# EAGLE design PowerPCB_mk2 (EAGLE 9.4.2)
Assembly variants: basic

## Sheet 1 of 2: DC-DC converters
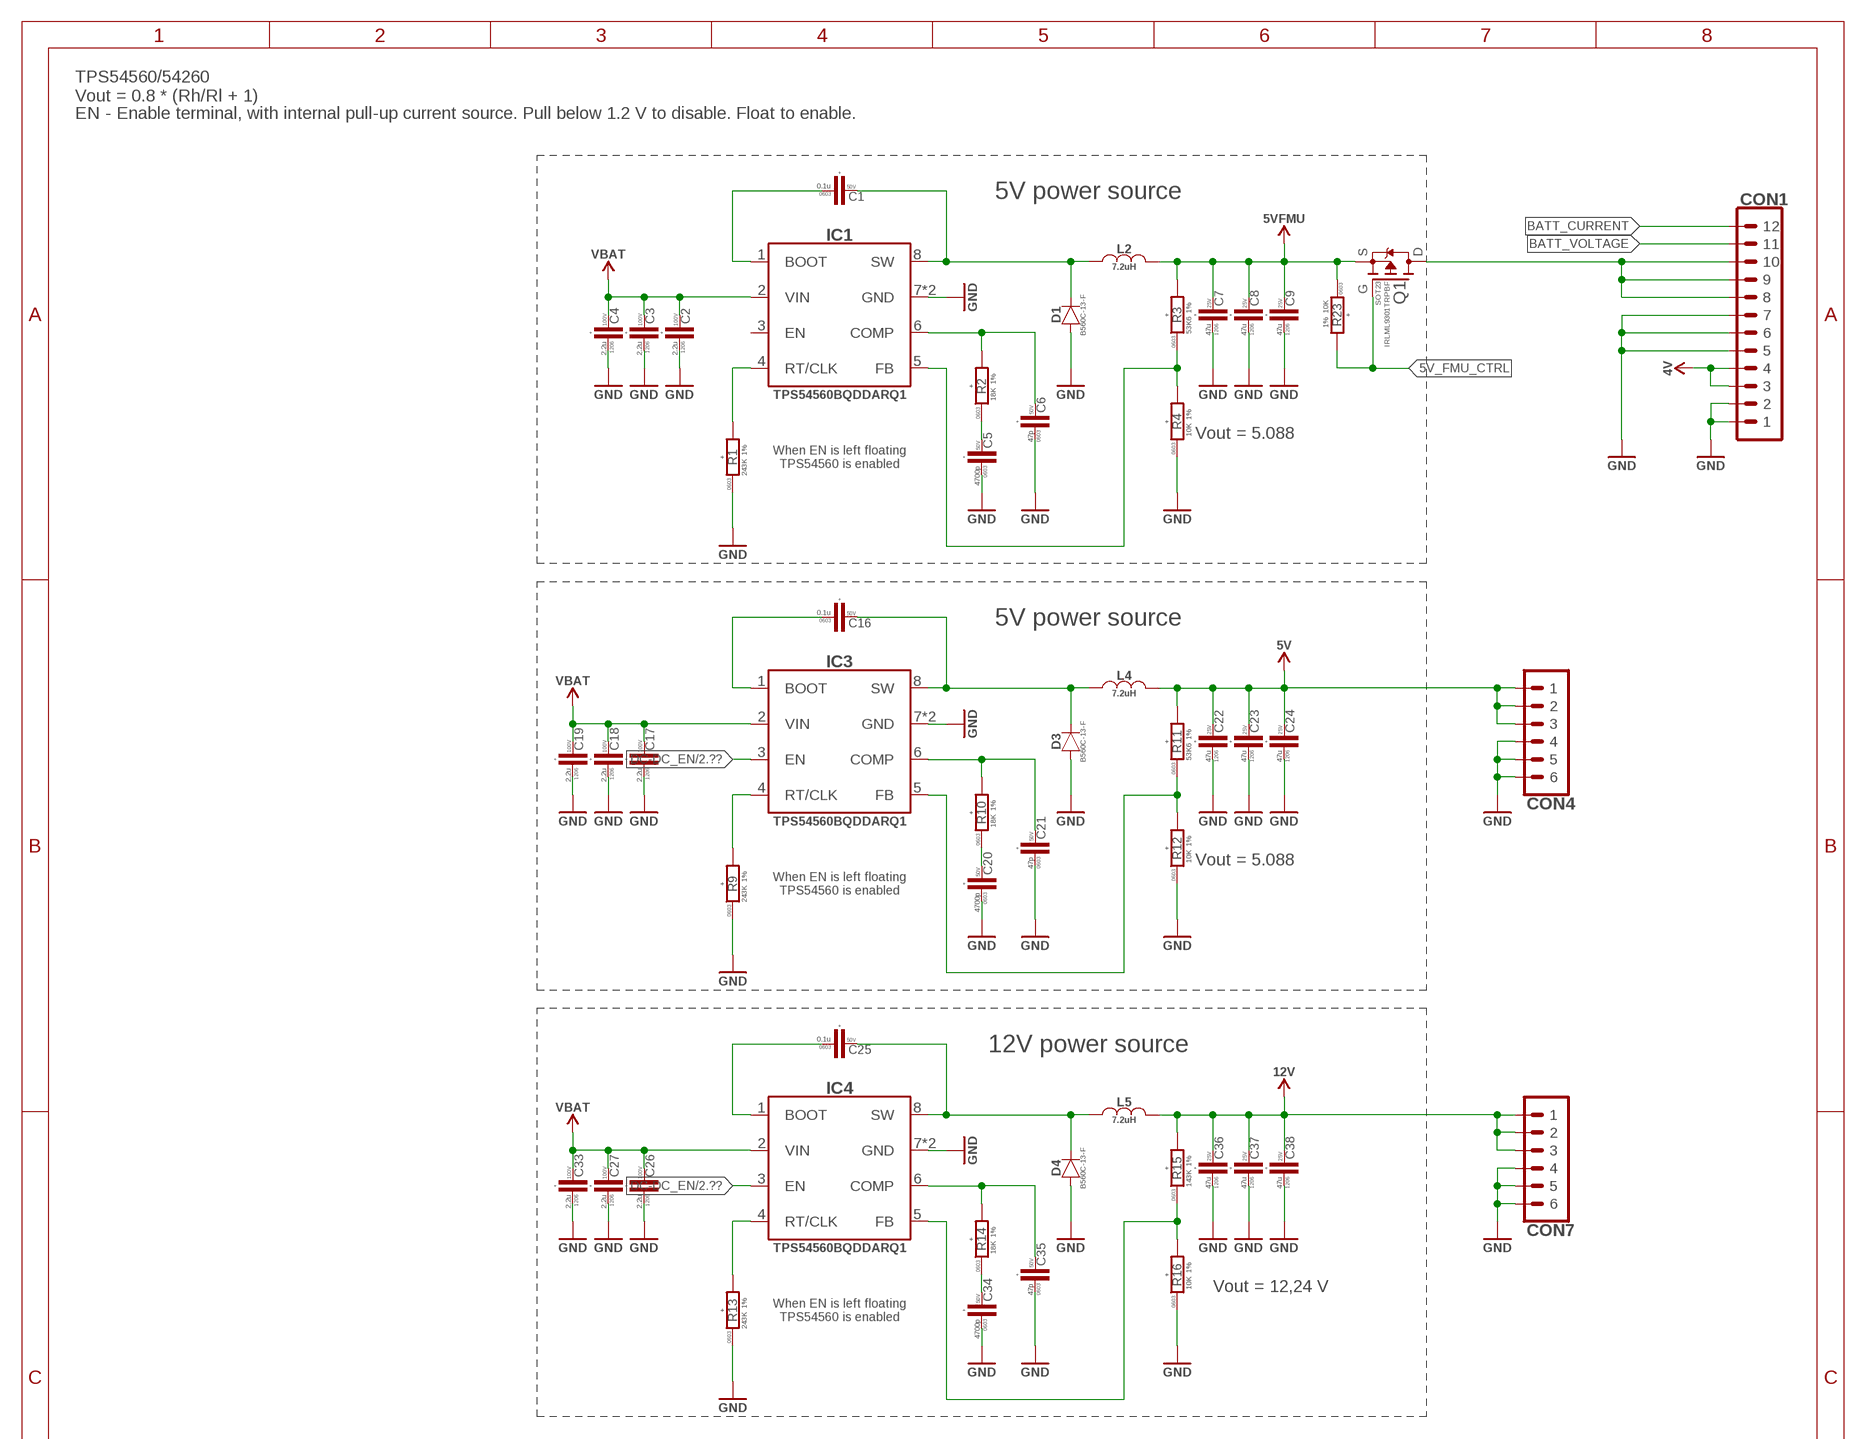
[diagram p0: schematic, sheet 1, part 1 of 2]
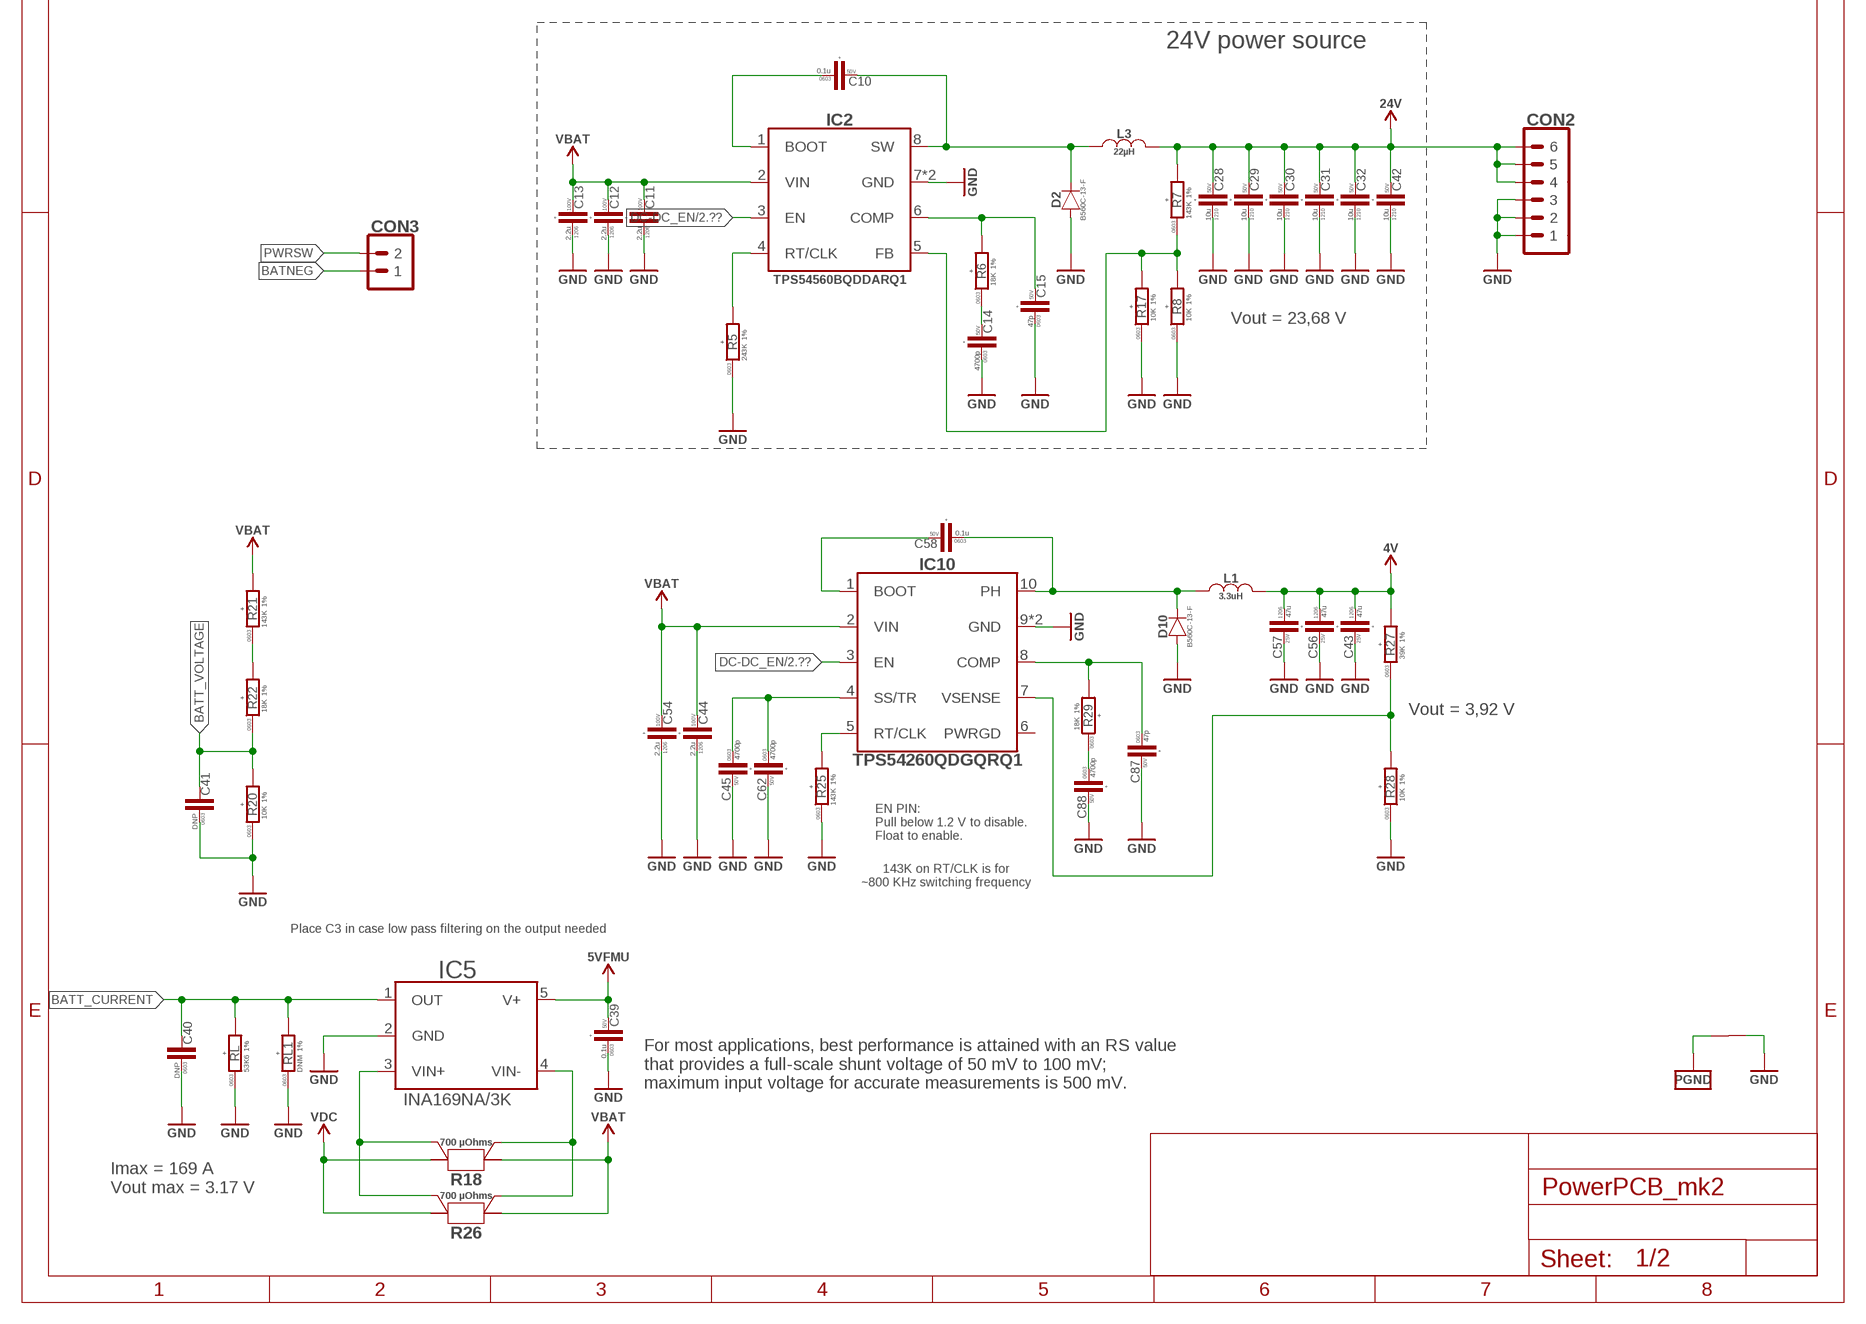
[diagram p1: schematic, sheet 1, part 2 of 2]

### Parts
C1  0.1u  C-0603  [C0603]
C2  2.2u  C-1206  [C1206]
C3  2.2u  C-1206  [C1206]
C4  2.2u  C-1206  [C1206]
C5  4700p  C-0603  [C0603]
C6  47p  C-0603  [C0603]
C7  47u  C-1206  [C1206]
C8  47u  C-1206  [C1206]
C9  47u  C-1206  [C1206]
C10  0.1u  C-0603  [C0603]
C11  2.2u  C-1206  [C1206]
C12  2.2u  C-1206  [C1206]
C13  2.2u  C-1206  [C1206]
C14  4700p  C-0603  [C0603]
C15  47p  C-0603  [C0603]
C16  0.1u  C-0603  [C0603]
C17  2.2u  C-1206  [C1206]
C18  2.2u  C-1206  [C1206]
C19  2.2u  C-1206  [C1206]
C20  4700p  C-0603  [C0603]
C21  47p  C-0603  [C0603]
C22  47u  C-1206  [C1206]
C23  47u  C-1206  [C1206]
C24  47u  C-1206  [C1206]
C25  0.1u  C-0603  [C0603]
C26  2.2u  C-1206  [C1206]
C27  2.2u  C-1206  [C1206]
C28  10u  C-1210  [C1210]
C29  10u  C-1210  [C1210]
C30  10u  C-1210  [C1210]
C31  10u  C-1210  [C1210]
C32  10u  C-1210  [C1210]
C33  2.2u  C-1206  [C1206]
C34  4700p  C-0603  [C0603]
C35  47p  C-0603  [C0603]
C36  47u  C-1206  [C1206]
C37  47u  C-1206  [C1206]
C38  47u  C-1206  [C1206]
C39  0.1u  C-0603  [C0603]
C40  DNP  C-0603  [C0603]  (not fitted in variant basic)
C41  DNP  C-0603  [C0603]  (not fitted in variant basic)
C42  10u  C-1210  [C1210]
C43  47u  C-1206  [C1206]
C44  2.2u  C-1206  [C1206]
C45  4700p  C-0603  [C0603]
C54  2.2u  C-1206  [C1206]
C56  47u  C-1206  [C1206]
C57  47u  C-1206  [C1206]
C58  0.1u  C-0603  [C0603]
C62  4700p  C-0603  [C0603]
C87  47p  C-0603  [C0603]
C88  4700p  C-0603  [C0603]
CON1  PINHEAD_1X12-2.54-FEMALE  [1X12-PTH-2.54-FEMALE]
CON2  PINHEAD_1X06-2.54-FEMALE  [1X06-PTH-2.54-FEMALE]
CON3  PINHEAD_1X02-2.54-FEMALE  [1X02-PTH-2.54-FEMALE]
CON4  PINHEAD_1X06-2.54-FEMALE  [1X06-PTH-2.54-FEMALE]
CON7  PINHEAD_1X06-2.54-FEMALE  [1X06-PTH-2.54-FEMALE]
D1  B560C  [DO-214AB(SMC)]
D2  B560C  [DO-214AB(SMC)]
D3  B560C  [DO-214AB(SMC)]
D4  B560C  [DO-214AB(SMC)]
D10  B560C  [DO-214AB(SMC)]
IC1  TPS54560B  [SOIC8-POWERPAD]
IC2  TPS54560B  [SOIC8-POWERPAD]
IC3  TPS54560B  [SOIC8-POWERPAD]
IC4  TPS54560B  [SOIC8-POWERPAD]
IC5  INA169  [SOT23-5]
IC10  TPS54260  [MSOP10]
J1  CONNECTION-7MM  [CONNECTION_7MM]  (not fitted in variant basic)
L1  3.3uH  3.3µH-IHLP-202BZ  [IHLP-2020BZ-01]
L2  7.2uH  7.2µH-1064  [1064]
L3  22µH  22µH-SRP1265A  [SRP1265A]
L4  7.2uH  7.2µH-1064  [1064]
L5  7.2uH  7.2µH-1064  [1064]
Q1  IRLML9301  [SOT23]
R1  243K  R-1%-0603  [R0603]
R2  18K  R-1%-0603  [R0603]
R3  53K6  R-1%-0603  [R0603]
R4  10K  R-1%-0603  [R0603]
R5  243K  R-1%-0603  [R0603]
R6  18K  R-1%-0603  [R0603]
R7  143K  R-1%-0603  [R0603]
R8  10K  R-1%-0603  [R0603]
R9  243K  R-1%-0603  [R0603]
R10  18K  R-1%-0603  [R0603]
R11  53K6  R-1%-0603  [R0603]
R12  10K  R-1%-0603  [R0603]
R13  243K  R-1%-0603  [R0603]
R14  18K  R-1%-0603  [R0603]
R15  143K  R-1%-0603  [R0603]
R16  10K  R-1%-0603  [R0603]
R17  10K  R-1%-0603  [R0603]
R18  700 µOhms  CURRENT_SHUNT_KELVIN-0.0005R-3920-KELVIN  [R3920-KELVIN]
R20  10K  R-1%-0603  [R0603]
R21  143K  R-1%-0603  [R0603]
R22  18K  R-1%-0603  [R0603]
R23  10K  R-1%-0603  [R0603]
R25  143K  R-1%-0603  [R0603]
R26  700 µOhms  CURRENT_SHUNT_KELVIN-0.0005R-3920-KELVIN  [R3920-KELVIN]
R27  39K  R-1%-0603  [R0603]
R28  10K  R-1%-0603  [R0603]
R29  18K  R-1%-0603  [R0603]
RL  53K6  R-1%-0603  [R0603]
RL1  DNM  R-1%-0603  [R0603]  (not fitted in variant basic)

### Nets
5V_FMU_CTRL: Q1.1(G) R23.2
5VFMU: C7.P$2 C8.P$2 C9.P$2 C39.2 IC5.5(V+) L2.2 Q1.2(S) R3.2 R23.1 ; also sheet 2
BATNEG: CON3.1
BATT_CURRENT: C40.2 CON1.12 IC5.1(OUT) RL1.2 RL.2
BATT_VOLTAGE: C41.2 CON1.11 R20.2 R22.1
BOOT: C58.2 IC10.1(BOOT)
BOOT1: C1.1 IC1.1(BOOT)
BOOT2: C16.1 IC3.1(BOOT)
BOOT3: C25.1 IC4.1(BOOT)
DC-DC_EN: IC2.3(EN) IC3.3(EN) IC4.3(EN) IC10.3(EN) ; also sheet 2
GND: C2.P$1 C3.P$1 C4.P$1 C5.1 C6.1 C7.P$1 C8.P$1 C9.P$1 C11.P$1 C12.P$1 C13.P$1 C14.1 C15.1 C17.P$1 C18.P$1 C19.P$1 C20.1 C21.1 C22.P$1 C23.P$1 C24.P$1 C26.P$1 C27.P$1 C28.1 C29.1 C30.1 C31.1 C32.1 C33.P$1 C34.1 C35.1 C36.P$1 C37.P$1 C38.P$1 C39.1 C40.1 C41.1 C42.1 C43.P$2 C44.P$1 C45.2 C54.P$1 C56.P$2 C57.P$2 C62.2 C87.2 C88.2 CON1.1 CON1.2 CON1.5 CON1.6 CON1.7 CON2.1 CON2.2 CON2.3 CON4.4 CON4.5 CON4.6 CON7.4 CON7.5 CON7.6 D1.A D2.A D3.A D4.A D10.A IC1.7(GND) IC1.P$1(GND) IC2.7(GND) IC2.P$1(GND) IC3.7(GND) IC3.P$1(GND) IC4.7(GND) IC4.P$1(GND) IC5.2(GND) IC10.9(GND) IC10.EP(GND) J1.2 R1.1 R4.1 R5.1 R8.1 R9.1 R12.1 R13.1 R16.1 R17.1 R20.1 R25.1 R28.1 RL1.1 RL.1 ; also sheet 2
N$1: IC1.4(RT/CLK) R1.2
N$2: IC3.4(RT/CLK) R9.2
N$3: C6.2 IC1.6(COMP) R2.2
N$4: C5.2 R2.1
N$5: IC1.5(FB) R3.1 R4.2
N$6: C21.2 IC3.6(COMP) R10.2
N$7: C10.1 IC2.1(BOOT)
N$8: C10.2 D2.C IC2.8(SW) L3.1
N$9: IC2.4(RT/CLK) R5.2
N$10: C15.2 IC2.6(COMP) R6.2
N$11: C14.2 R6.1
N$12: IC2.5(FB) R7.1 R8.2 R17.2
N$13: C20.2 R10.1
N$14: IC4.4(RT/CLK) R13.2
N$15: IC3.5(FB) R11.1 R12.2
N$16: C35.2 IC4.6(COMP) R14.2
N$17: C34.2 R14.1
N$18: IC4.5(FB) R15.1 R16.2
N$19: IC5.4(VIN-) R18.S2 R26.S2
N$20: C45.1 C62.1 IC10.4(SS/TR)
N$21: IC5.3(VIN+) R18.S1 R26.S1
N$22: R21.1 R22.2
N$27: CON1.8 CON1.9 CON1.10 Q1.3(D)
N$38: C87.1 IC10.8(COMP) R29.2
N$39: IC10.5(RT/CLK) R25.2
N$50: C88.1 R29.1
PGND: J1.1 ; also sheet 2
PH: C58.1 D10.C IC10.10(PH) L1.P$1
PWRSW: CON3.2
SW1: C1.2 D1.C IC1.8(SW) L2.1
SW2: C16.2 D3.C IC3.8(SW) L4.1
SW3: C25.2 D4.C IC4.8(SW) L5.1
VBAT [HV]: C2.P$2 C3.P$2 C4.P$2 C11.P$2 C12.P$2 C13.P$2 C17.P$2 C18.P$2 C19.P$2 C26.P$2 C27.P$2 C33.P$2 C44.P$2 C54.P$2 IC1.2(VIN) IC2.2(VIN) IC3.2(VIN) IC4.2(VIN) IC10.2(VIN) R18.2 R18.22 R21.2 R26.2 R26.22 ; also sheet 2
VDC [HV]: R18.1 R18.11 R26.1 R26.11 ; also sheet 2
VDD_4V: C43.P$1 C56.P$1 C57.P$1 CON1.3 CON1.4 L1.P$2 R27.2 ; supply symbol labelled 4V
VDD_5V: C22.P$2 C23.P$2 C24.P$2 CON4.1 CON4.2 CON4.3 L4.2 R11.2 ; supply symbol labelled 5V
VDD_12V: C36.P$2 C37.P$2 C38.P$2 CON7.1 CON7.2 CON7.3 L5.2 R15.2 ; supply symbol labelled 12V
VDD_24V: C28.2 C29.2 C30.2 C31.2 C32.2 C42.2 CON2.4 CON2.5 CON2.6 L3.2 R7.2 ; supply symbol labelled 24V
VSENSE: IC10.7(VSENSE) R27.1 R28.2
Unconnected: IC1.3(EN) IC10.6(PWRGD)

### Notes on the sheet
- TPS54560/54260
  Vout = 0.8 * (Rh/Rl + 1)
- EN - Enable terminal, with internal pull-up current source. Pull below 1.2 V to disable. Float to enable.
- 5V power source
- Vout = 5.088
- When EN is left floating
  TPS54560 is enabled
- 5V power source
- Vout = 5.088
- When EN is left floating
  TPS54560 is enabled
- 12V power source
- Vout = 12,24 V
- When EN is left floating
  TPS54560 is enabled
- 24V power source
- Vout = 23,68 V
- Vout = 3,92 V
- EN PIN:
  Pull below 1.2 V to disable. 
  Float to enable.
- 143K on RT/CLK is for
  ~800 KHz switching frequency
- Place C3 in case low pass filtering on the output needed
- For most applications, best performance is attained with an RS value 
  that provides a full-scale shunt voltage of 50 mV to 100 mV;
  maximum input voltage for accurate measurements is 500 mV.
- Imax = 169 A
  Vout max = 3.17 V

## Sheet 2 of 2: ESC and battery power connections
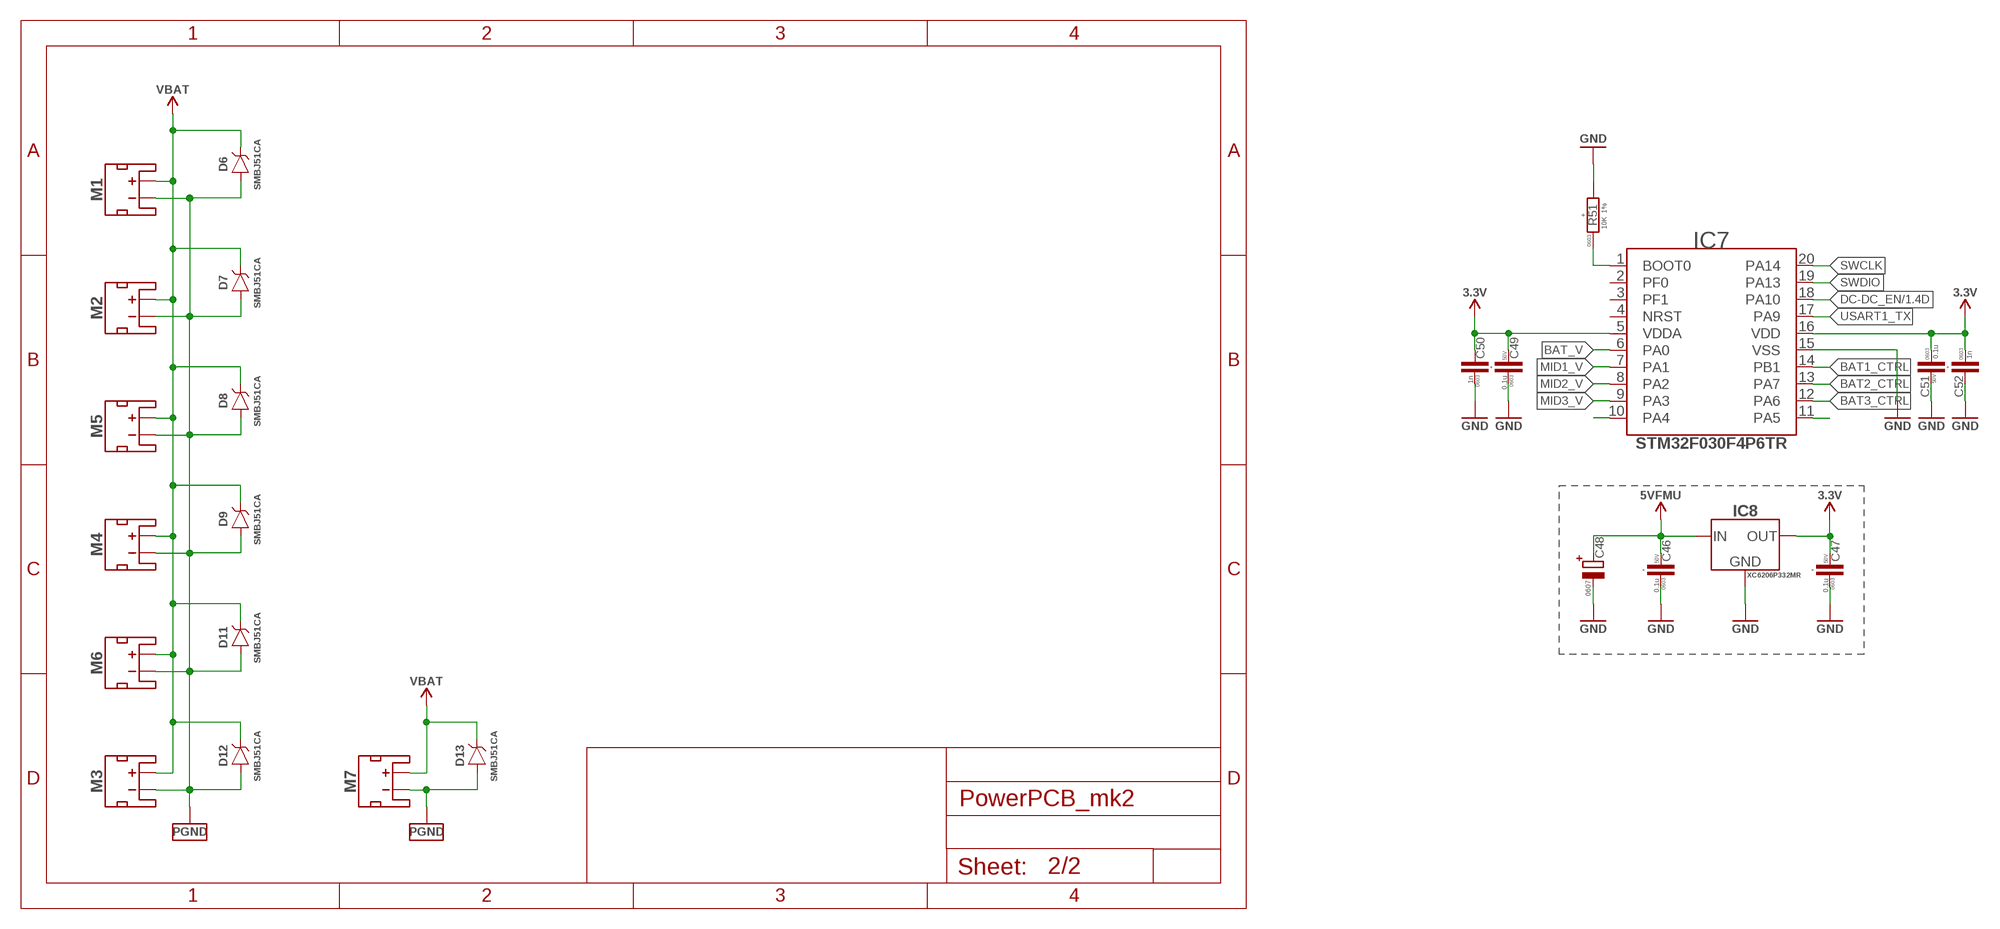
[diagram p2: schematic, sheet 2, part 1 of 2]
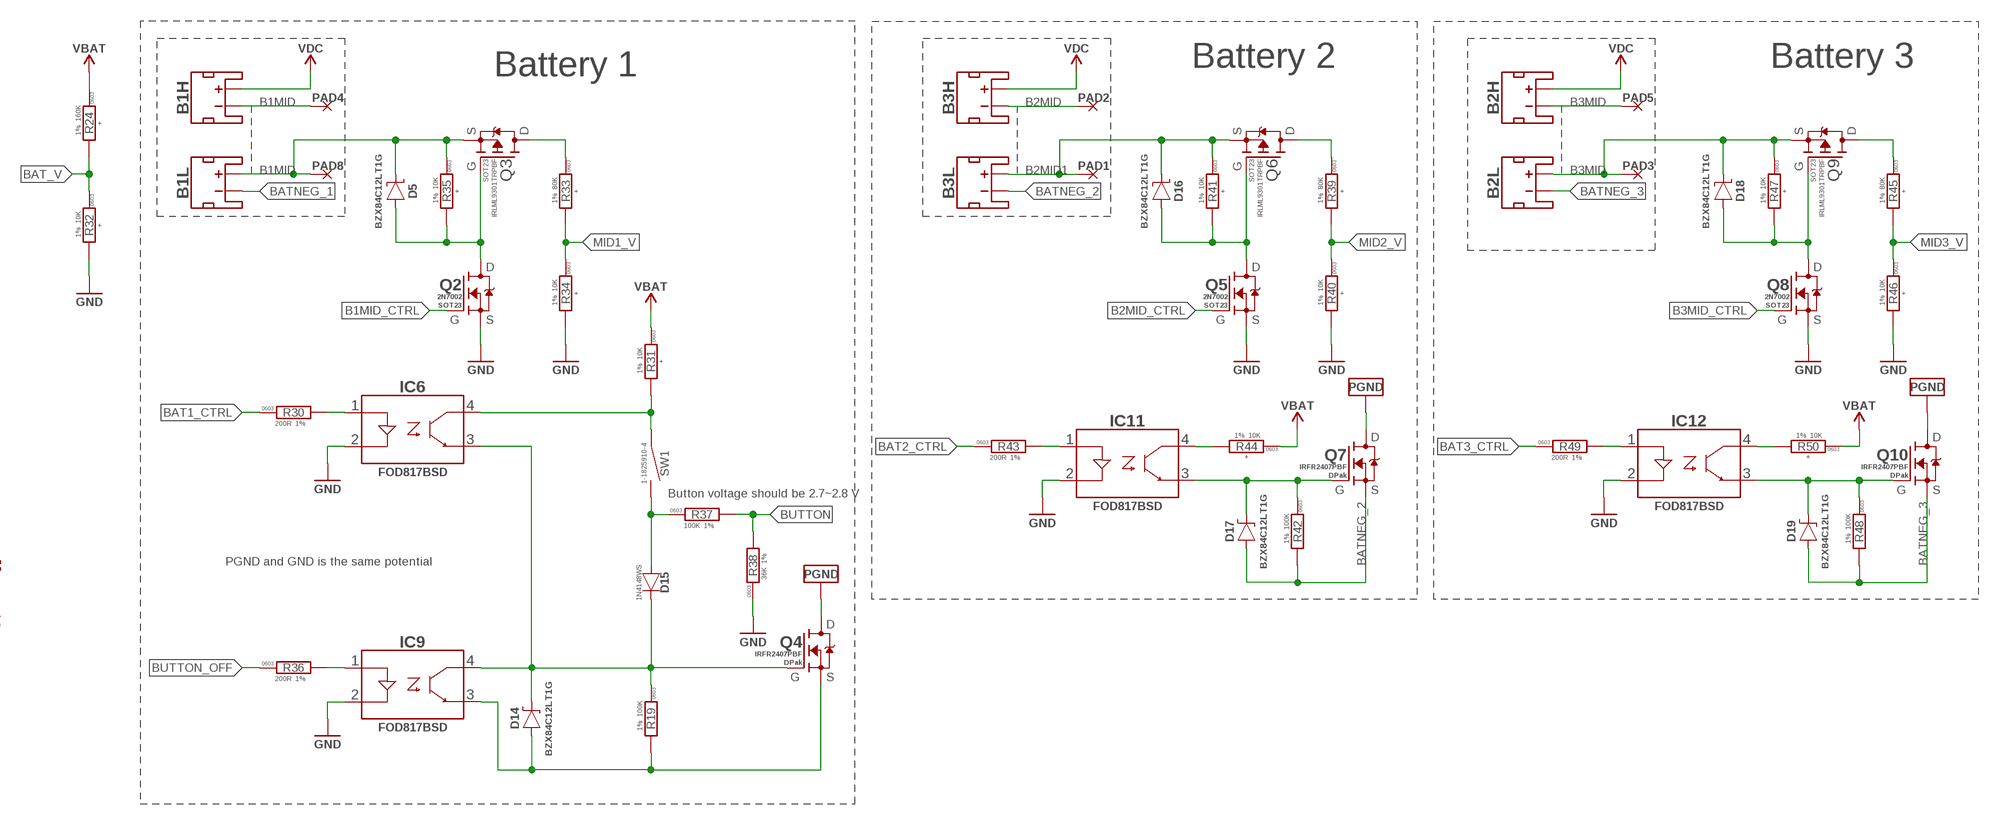
[diagram p3: schematic, sheet 2, part 2 of 2]

### Parts
B1H  BATTERY_CON-XT60PW-M  [XT60PW-M]
B1L  BATTERY_CON-XT60PW-M  [XT60PW-M]
B2H  BATTERY_CON-XT60PW-M  [XT60PW-M]
B2L  BATTERY_CON-XT60PW-M  [XT60PW-M]
B3H  BATTERY_CON-XT60PW-M  [XT60PW-M]
B3L  BATTERY_CON-XT60PW-M  [XT60PW-M]
C46  0.1u  C-0603  [C0603]
C47  0.1u  C-0603  [C0603]
C48  CPOL-SMD_6.3X7.7  [CAP_SMD_6.3X7.7]
C49  0.1u  C-0603  [C0603]
C50  1n  C-0603  [C0603]
C51  0.1u  C-0603  [C0603]
C52  1n  C-0603  [C0603]
D5  BZX84C12  [SOT23]
D6  SMBJ51CA-SMB  [DO-214AA(SMB)]
D7  SMBJ51CA-SMB  [DO-214AA(SMB)]
D8  SMBJ51CA-SMB  [DO-214AA(SMB)]
D9  SMBJ51CA-SMB  [DO-214AA(SMB)]
D11  SMBJ51CA-SMB  [DO-214AA(SMB)]
D12  SMBJ51CA-SMB  [DO-214AA(SMB)]
D13  SMBJ51CA-SMB  [DO-214AA(SMB)]
D14  BZX84C12  [SOT23]
D15  1N4148WS  [SOD323]
D16  BZX84C12  [SOT23]
D17  BZX84C12  [SOT23]
D18  BZX84C12  [SOT23]
D19  BZX84C12  [SOT23]
IC6  FOD817  [4-SMD]
IC7  STM32F030F4P6  [TSSOP20]
IC8  XC6206P332MR  [SOT23]
IC9  FOD817  [4-SMD]
IC11  FOD817  [4-SMD]
IC12  FOD817  [4-SMD]
M1  BATTERY_CON-XT30-RA  [XT30-RA]
M2  BATTERY_CON-XT30-RA  [XT30-RA]
M3  BATTERY_CON-XT30-RA  [XT30-RA]
M4  BATTERY_CON-XT30-RA  [XT30-RA]
M5  BATTERY_CON-XT30-RA  [XT30-RA]
M6  BATTERY_CON-XT30-RA  [XT30-RA]
M7  BATTERY_CON-XT30-RA  [XT30-RA]
PAD1  PAD-10X4  [10X4]  (not fitted in variant basic)
PAD2  PAD-10X4  [10X4]  (not fitted in variant basic)
PAD3  PAD-10X4  [10X4]  (not fitted in variant basic)
PAD4  PAD-10X4  [10X4]  (not fitted in variant basic)
PAD5  PAD-10X4  [10X4]  (not fitted in variant basic)
PAD8  PAD-10X4  [10X4]  (not fitted in variant basic)
Q2  2N7002  [SOT23]
Q3  IRLML9301  [SOT23]
Q4  IRFR2407PBF  [D-PAK]
Q5  2N7002  [SOT23]
Q6  IRLML9301  [SOT23]
Q7  IRFR2407PBF  [D-PAK]
Q8  2N7002  [SOT23]
Q9  IRLML9301  [SOT23]
Q10  IRFR2407PBF  [D-PAK]
R19  100K  R-1%-0603  [R0603]
R24  160K  R-1%-0603  [R0603]
R30  200R  R-1%-0603  [R0603]
R31  10K  R-1%-0603  [R0603]
R32  10K  R-1%-0603  [R0603]
R33  80K  R-1%-0603  [R0603]
R34  10K  R-1%-0603  [R0603]
R35  10K  R-1%-0603  [R0603]
R36  200R  R-1%-0603  [R0603]
R37  100K  R-1%-0603  [R0603]
R38  36K  R-1%-0603  [R0603]
R39  80K  R-1%-0603  [R0603]
R40  10K  R-1%-0603  [R0603]
R41  10K  R-1%-0603  [R0603]
R42  100K  R-1%-0603  [R0603]
R43  200R  R-1%-0603  [R0603]
R44  10K  R-1%-0603  [R0603]
R45  80K  R-1%-0603  [R0603]
R46  10K  R-1%-0603  [R0603]
R47  10K  R-1%-0603  [R0603]
R48  100K  R-1%-0603  [R0603]
R49  200R  R-1%-0603  [R0603]
R50  10K  R-1%-0603  [R0603]
R51  10K  R-1%-0603  [R0603]
SW1  TACT_SWITCH-1-1825910-4  [1-1825910-4]

### Nets
5VFMU: C46.2 C48.+ IC8.3(IN) ; also sheet 1
B1MID [HV]: B1H.- B1L.+ D5.3(C) PAD4.P$1 PAD8.P$1 Q3.2(S) R35.1
B1MID_CTRL: Q2.1(G)
B2MID [HV]: B3H.- PAD2.P$1
B2MID1 [HV]: B3L.+ D16.3(C) PAD1.P$1 Q6.2(S) R41.1
B2MID_CTRL: Q5.1(G)
B3MID [HV]: B2H.- B2L.+ D18.3(C) PAD3.P$1 PAD5.P$1 Q9.2(S) R47.1
B3MID_CTRL: Q8.1(G)
BAT1_CTRL: IC7.14(PB1) R30.1
BAT2_CTRL: IC7.13(PA7) R43.1
BAT3_CTRL: IC7.12(PA6) R49.1
BAT_V: IC7.6(PA0) R24.2 R32.1
BATNEG_1: B1L.- D14.1(A) IC9.3(EMITTER) Q4.S R19.2
BATNEG_2: B3L.- D17.1(A) Q7.S R42.2
BATNEG_3: B2L.- D19.1(A) Q10.S R48.2
BUTTON: R37.2 R38.2
BUTTON_OFF: R36.1
DC-DC_EN: IC7.18(PA10) ; also sheet 1
GND: C46.1 C47.1 C48.- C49.1 C50.1 C51.2 C52.2 IC6.2(C) IC7.15(VSS) IC8.1(GND) IC9.2(C) IC11.2(C) IC12.2(C) Q2.2(S) Q5.2(S) Q8.2(S) R32.2 R34.2 R38.1 R40.2 R46.2 R51.2 ; also sheet 1
MID1_V: IC7.7(PA1) R33.2 R34.1
MID2_V: IC7.8(PA2) R39.2 R40.1
MID3_V: IC7.9(PA3) R45.2 R46.1
N$23 [HV]: D14.3(C) D15.C IC6.3(EMITTER) IC9.4(COLLECTOR) Q4.G R19.1
N$24: IC6.1(A) R30.2
N$25 [HV]: IC6.4(COLLECTOR) R31.2 SW1.1 SW1.2
N$26: IC9.1(A) R36.2
N$28 [HV]: D15.A R37.1 SW1.3 SW1.4
N$29: D5.1(A) Q2.3(D) Q3.1(G) R35.2
N$30: Q3.3(D) R33.1
N$31: Q6.3(D) R39.1
N$32: D16.1(A) Q5.3(D) Q6.1(G) R41.2
N$33: IC11.1(A) R43.2
N$34 [HV]: D17.3(C) IC11.3(EMITTER) Q7.G R42.1
N$35: Q9.3(D) R45.1
N$36 [HV]: IC11.4(COLLECTOR) R44.2
N$37: D18.1(A) Q8.3(D) Q9.1(G) R47.2
N$40: IC12.1(A) R49.2
N$41 [HV]: D19.3(C) IC12.3(EMITTER) Q10.G R48.1
N$42 [HV]: IC12.4(COLLECTOR) R50.2
N$43: IC7.1(BOOT0) R51.1
N$47: IC7.11(PA5)
N$51: IC7.10(PA4)
PGND: D6.A D7.A D8.A D9.A D11.A D12.A D13.A M1.- M2.- M3.- M4.- M5.- M6.- M7.- Q4.D Q7.D Q10.D ; also sheet 1
SWCLK: IC7.20(PA14)
SWDIO: IC7.19(PA13)
USART1_TX: IC7.17(PA9)
VBAT [HV]: D6.C D7.C D8.C D9.C D11.C D12.C D13.C M1.+ M2.+ M3.+ M4.+ M5.+ M6.+ M7.+ R24.1 R31.1 R44.1 R50.1 ; also sheet 1
VDC [HV]: B1H.+ B2H.+ B3H.+ ; also sheet 1
VDD_3V3: C47.2 C49.2 C50.2 C51.1 C52.1 IC7.5(VDDA) IC7.16(VDD) IC8.2(OUT) ; supply symbol labelled 3.3V
Unconnected: B1H.P$1(PAD1) B1H.P$2(PAD2) B1H.P$3(PAD1) B1H.P$4(PAD2) B1L.P$1(PAD1) B1L.P$2(PAD2) B1L.P$3(PAD1) B1L.P$4(PAD2) B2H.P$1(PAD1) B2H.P$2(PAD2) B2H.P$3(PAD1) B2H.P$4(PAD2) B2L.P$1(PAD1) B2L.P$2(PAD2) B2L.P$3(PAD1) B2L.P$4(PAD2) B3H.P$1(PAD1) B3H.P$2(PAD2) B3H.P$3(PAD1) B3H.P$4(PAD2) B3L.P$1(PAD1) B3L.P$2(PAD2) B3L.P$3(PAD1) B3L.P$4(PAD2) IC7.2(PF0) IC7.3(PF1) IC7.4(NRST) M1.P$3(PAD1) M1.P$4(PAD2) M2.P$3(PAD1) M2.P$4(PAD2) M3.P$3(PAD1) M3.P$4(PAD2) M4.P$3(PAD1) M4.P$4(PAD2) M5.P$3(PAD1) M5.P$4(PAD2) M6.P$3(PAD1) M6.P$4(PAD2) M7.P$3(PAD1) M7.P$4(PAD2)

### Notes on the sheet
- Battery 1 | Battery 2 | Battery 3
- Button voltage should be 2.7~2.8 V
- PGND and GND is the same potential

## Library data of the parts
B1H B1L B2H B2L B3H B3L = Connectors:BATTERY_CON
C1 C10 C16 C25 C39 C46 C47 C49 C51 C58 = rc:C; ALLOCATED: +; LCSC#: C14663; MANF: YAGEO; MANF#: CC0603KRX7R9BB104; PACKAGE: 0603; VOLTAGE: 50V
C2-C4 C11-C13 C17-C19 C26 C27 C33 C44 C54 = rc:C; ALLOCATED: +; LCSC#: C170101; MANF: Samsung Electro-Mechanics; MANF#: CL31B225KCHSNNE; PACKAGE: 1206; VOLTAGE: 100V
C5 C14 C20 C34 C45 C62 C88 = rc:C; ALLOCATED: +; LCSC#: C106218; MANF: YAGEO; MANF#: CC0603KRX7R9BB472; PACKAGE: 0603; VOLTAGE: 50V
C6 C15 C21 C35 C87 = rc:C; ALLOCATED: +; LCSC#: C1671; MANF: Samsung Electro-Mechanics; MANF#: CL10C470JB8NNNC; PACKAGE: 0603; VOLTAGE: 50V
C7-C9 C22-C24 C36-C38 C43 C56 C57 = rc:C; ALLOCATED: +; LCSC#: C403725; MANF: Murata Electronics; MANF#: GRM31CR61E476ME44L; PACKAGE: 1206; VOLTAGE: 25V
C28-C32 C42 = rc:C; ALLOCATED: +; LCSC#: C77102; MANF: Murata Electronics; MANF#: GRM32ER71H106K; PACKAGE: 1210; VOLTAGE: 50V
C40 C41 C50 C52 = rc:C; PACKAGE: 0603
C48 = rc:CPOL: Polar electrolytic or tantalum capacitor; PACKAGE: 0607
CON1 = pinhead:PINHEAD_1X12
CON2 CON4 CON7 = pinhead:PINHEAD_1X06: pinheader 6P
CON3 = pinhead:PINHEAD_1X02: pinheader 2P
D1-D4 D10 = Diodes:B560C: 60V 700mV@5A 5A SMC(DO-214AB) Schottky Barrier Diodes (SBD) ROHS; LCSC#: C85100; MANF: Diodes Incorporated; MANF#: B560C-13-F
D5 D14 D16-D19 = Diodes:BZX84C: Zener Diode 250mW ±5% Surface Mount SOT-23-3 (TO-236); DIGIKEY#: BZX84C12LT1GOSTR-ND; LCSC#: C82475; MANF: ON Semiconductor; MANF#: BZX84C12LT1G
D6-D9 D11-D13 = TVS_diodes:SMBJ51CA: TVS DIODE 51VWM SMD; DIGIKEY#: SMBJ51CABCT-ND; MANF: Bourns Inc; MANF#: SMBJ51CA
D15 = Diodes:1N4148WS: 100V +150℃@(Tj) 200mW Single 1.25V@150mA 4ns 1μA@75V 150mA SOD-323 Switching Diode; LCSC#: C2128; MANF: Jiangsu Changjing Electronics Technology Co., Ltd.; MANF#: 1N4148WS
IC1-IC4 = dc-dc:TPS54560B: Switching Voltage Regulators 4.5V to 60V Input, 5A, Step-Down DC-DC Converter with Eco-mode™ 8-SO PowerPAD -40 to 125 Datasheet <https://www.ti.com/lit/ds/symlink/tps54560b.pdf?ts=1655463669009>; LCSC#: C1355654; MANF: Texas Instruments; MANF#: TPS54560BQDDARQ1
IC5 = misc:INA169: High-Side Measurement Current Shunt Monitor; LCSC#: C44322; MANF: Texas Instruments; MANF#: INA169NA/3K
IC6 IC9 IC11 IC12 = misc:FOD817: Optoisolator Transistor Output 5000Vrms 1 Channel 4-SMD; DIGIKEY#: FOD817BSDTR-ND; LCSC#: C139543; MANF: Fairchild Semiconductor; MANF#: FOD817BSD
IC7 = stm32:STM32F030F4P6: IC MCU 32BIT 16KB FLASH 20TSSOP; DIGIKEY#: STM32F030F4P6TR-ND; MANF: STMicroelectronics; MANF#: STM32F030F4P6TR; TEMPERATURE: -40°C ~ 85°C
IC8 = linear regulators:XC6206P332MR: 200mA 680mV@(100mA) Fixed 3.3V~3.3V Positive 1 6V SOT-23-3L Linear Voltage Regulators (LDO) ROHS; LCSC#: C5446; LCSC_TYPE: BASIC; MANF: Torex Semicon; MANF#: XC6206P332MR
IC10 = dc-dc:TPS54260: IC REG BUCK ADJ 2.5A 10MSOP Datasheet <http://www.ti.com/lit/ds/slvsa86c/slvsa86c.pdf>; DIGIKEY#: 296-28183-1-ND; LCSC#: C51800; MANF: Texas Instruments; MANF#: TPS54260QDGQRQ1
J1 = misc:CONNECTION
L1 = power_inductors:3.3µH; LCSC#: C844988; MANF: Vishay Precision Group; MANF#: IHLP2020BZER3R3M01
L2 L4 L5 = power_inductors:7.2µH; DC_RESISTANCE: 11.3 mOhm; MANF: Wurth Elektronik; MANF#: 7447798720; RATED_CURRENT: 7.9A
L3 = power_inductors:22µH: Wirewound Inductor; LCSC#: C2041465; MANF: Bourns; MANF#: SRP1265A-220M; RATED_CURRENT: 9 A
M1-M7 = Connectors:BATTERY_CON; LINK: https://www.tme.eu/en/details/xt30pw-m/dc-power-connectors/amass/; MANF: AMASS; MANF#: XT30PW-M
PAD1-PAD5 PAD8 = PADS:PAD
Q1 Q3 Q6 Q9 = mosfet:IRLML9301: MOSFET P-CH 30V 3.6A SOT-23-3; DIGIKEY#: IRLML9301TRPBFTR-ND; LCSC#: C710004; MANF: Infineon Technologies; MANF#: IRLML9301TRPBF; PACKAGE: SOT23
Q2 Q5 Q8 = mosfet:2N7002: N-Channel 60V 115mA 2.5V @ 250uA 7.5Ω @ 500mA,10V 200mW SOT-23(SOT-23-3) MOSFET RoHS; LCSC#: C8545; MANF: Changjiang Electronics Tech (CJ); MANF#: 2N7002; PACKAGE: SOT23
Q4 Q7 Q10 = mosfet:IRFR2407PBF: N-Channel 75V 42A power MOSFET, Rdson = 0.026 Ohm; LCSC#: C40514; MANF: International Rectifier; MANF#: IRFR2407PBF; PACKAGE: DPak
R1 R5 R9 R13 = rc:R; ALLOCATED: +; LCSC#: C23351; MANF: UNI-ROYAL(Uniroyal Elec); MANF#: 0603WAF2433T5E; PACKAGE: 0603; TOLERANCE: 1%
R2 R6 R10 R14 R22 R29 = rc:R; ALLOCATED: +; LCSC#: C25810; MANF: UNI-ROYAL; MANF#: 0603WAF1802T5E; PACKAGE: 0603; TOLERANCE: 1%
R3 R11 RL = rc:R; ALLOCATED: +; LCSC#: C23074; MANF: UNI-ROYAL(Uniroyal Elec); MANF#: 0603WAF5362T5E; PACKAGE: 0603; TOLERANCE: 1%
R4 R8 R12 R16 R17 R20 R23 R24 R28 R31-R35 R39-R41 R44-R47 R50 R51 = rc:R; ALLOCATED: +; LCSC#: C160601; MANF: YAGEO; MANF#: RT0603FRD0710KL; PACKAGE: 0603; TOLERANCE: 1%
R7 R15 R21 R25 = rc:R; ALLOCATED: +; LCSC#: C22877; MANF: UNI-ROYAL(Uniroyal Elec); MANF#: 0603WAF1433T5E; PACKAGE: 0603; TOLERANCE: 1%
R18 R26 = SHUNT_RESISTORS:CURRENT_SHUNT_KELVIN; MANF: TT Electronics; MANF#: LRMAP3920B-R0007FT; OPERATING_TEMP: -55°C ~ 170°C; PACKAGE: 3920; POWER: 5W; TC: ±60ppm/°C; TOLERANCE: ±1%; VALUE: 500 µOhms
R19 R30 R36-R38 R42 R43 R48 R49 = rc:R; PACKAGE: 0603; TOLERANCE: 1%
R27 RL1 = rc:R; ALLOCATED: +; LCSC#: C23153; MANF: UNI-ROYAL(Uniroyal Elec); MANF#: 0603WAF3902T5E; PACKAGE: 0603; TOLERANCE: 1%
SW1 = mechanical:TACT_SWITCH: tact switch; MANF: TE Connectivity; MANF#: 1-1825910-4

## Net classes
1 HV: clearance 0.3 mm to class 0, clearance 0.3 mm

## Board
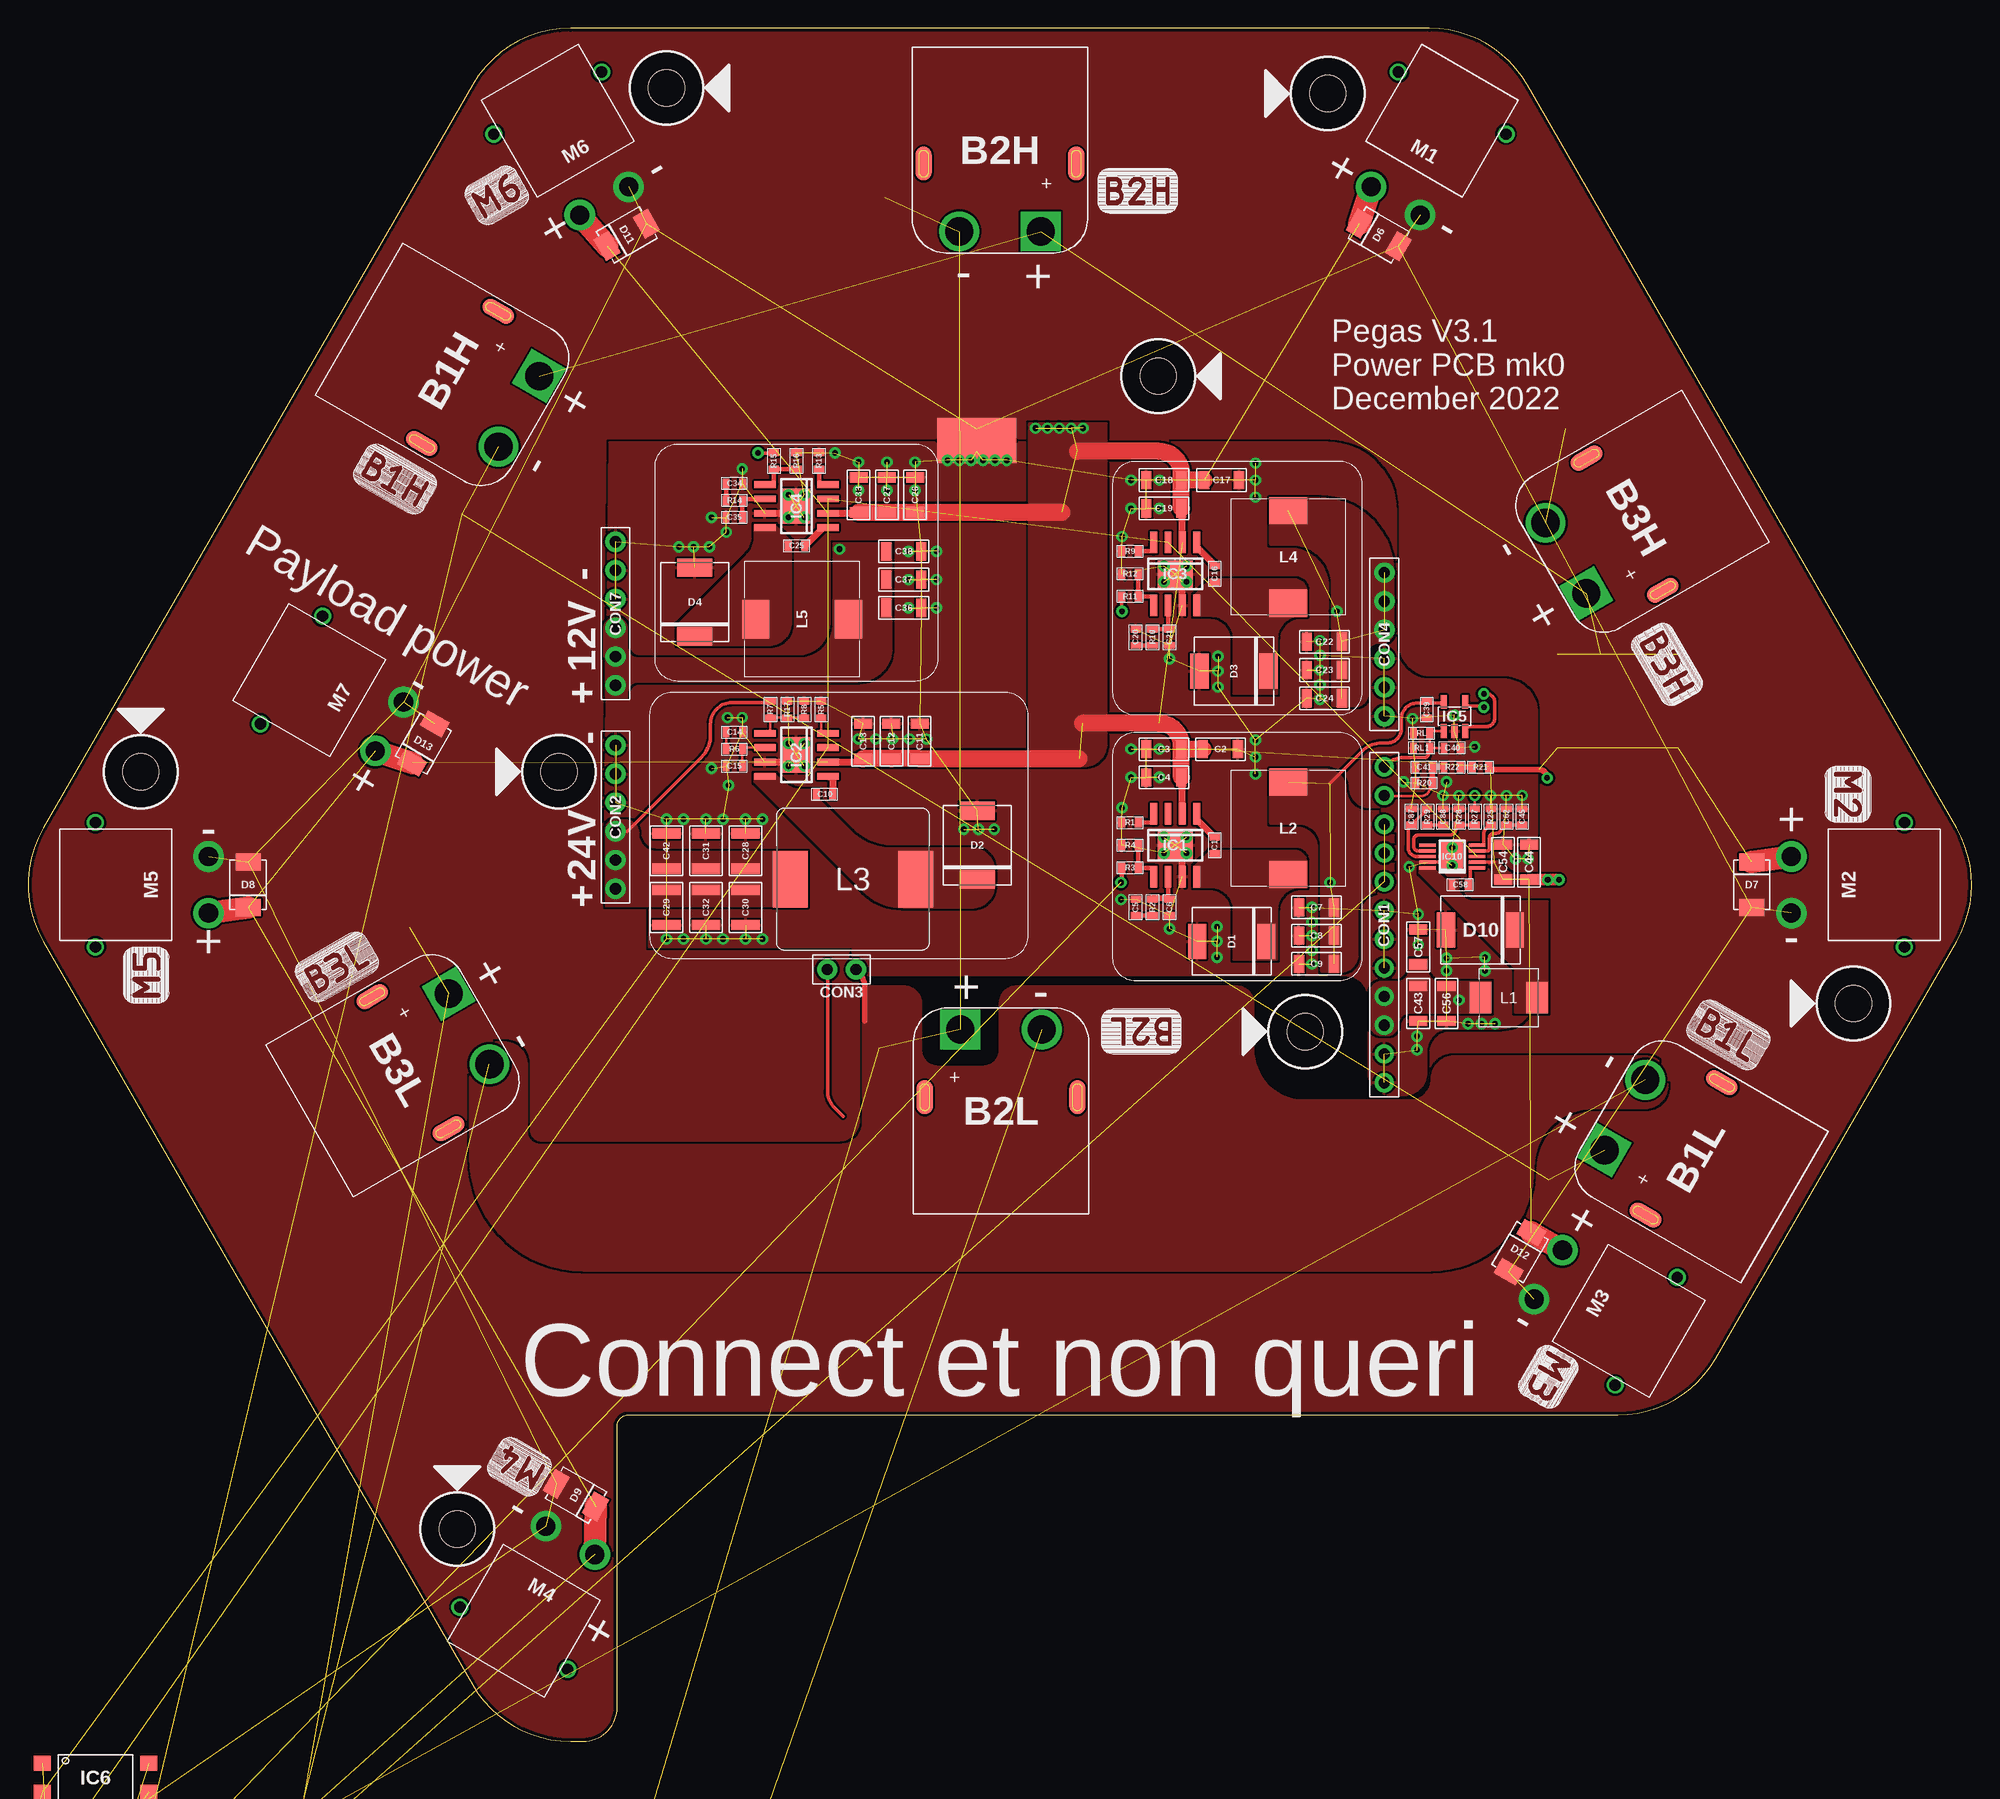
[diagram p4: board, top side]
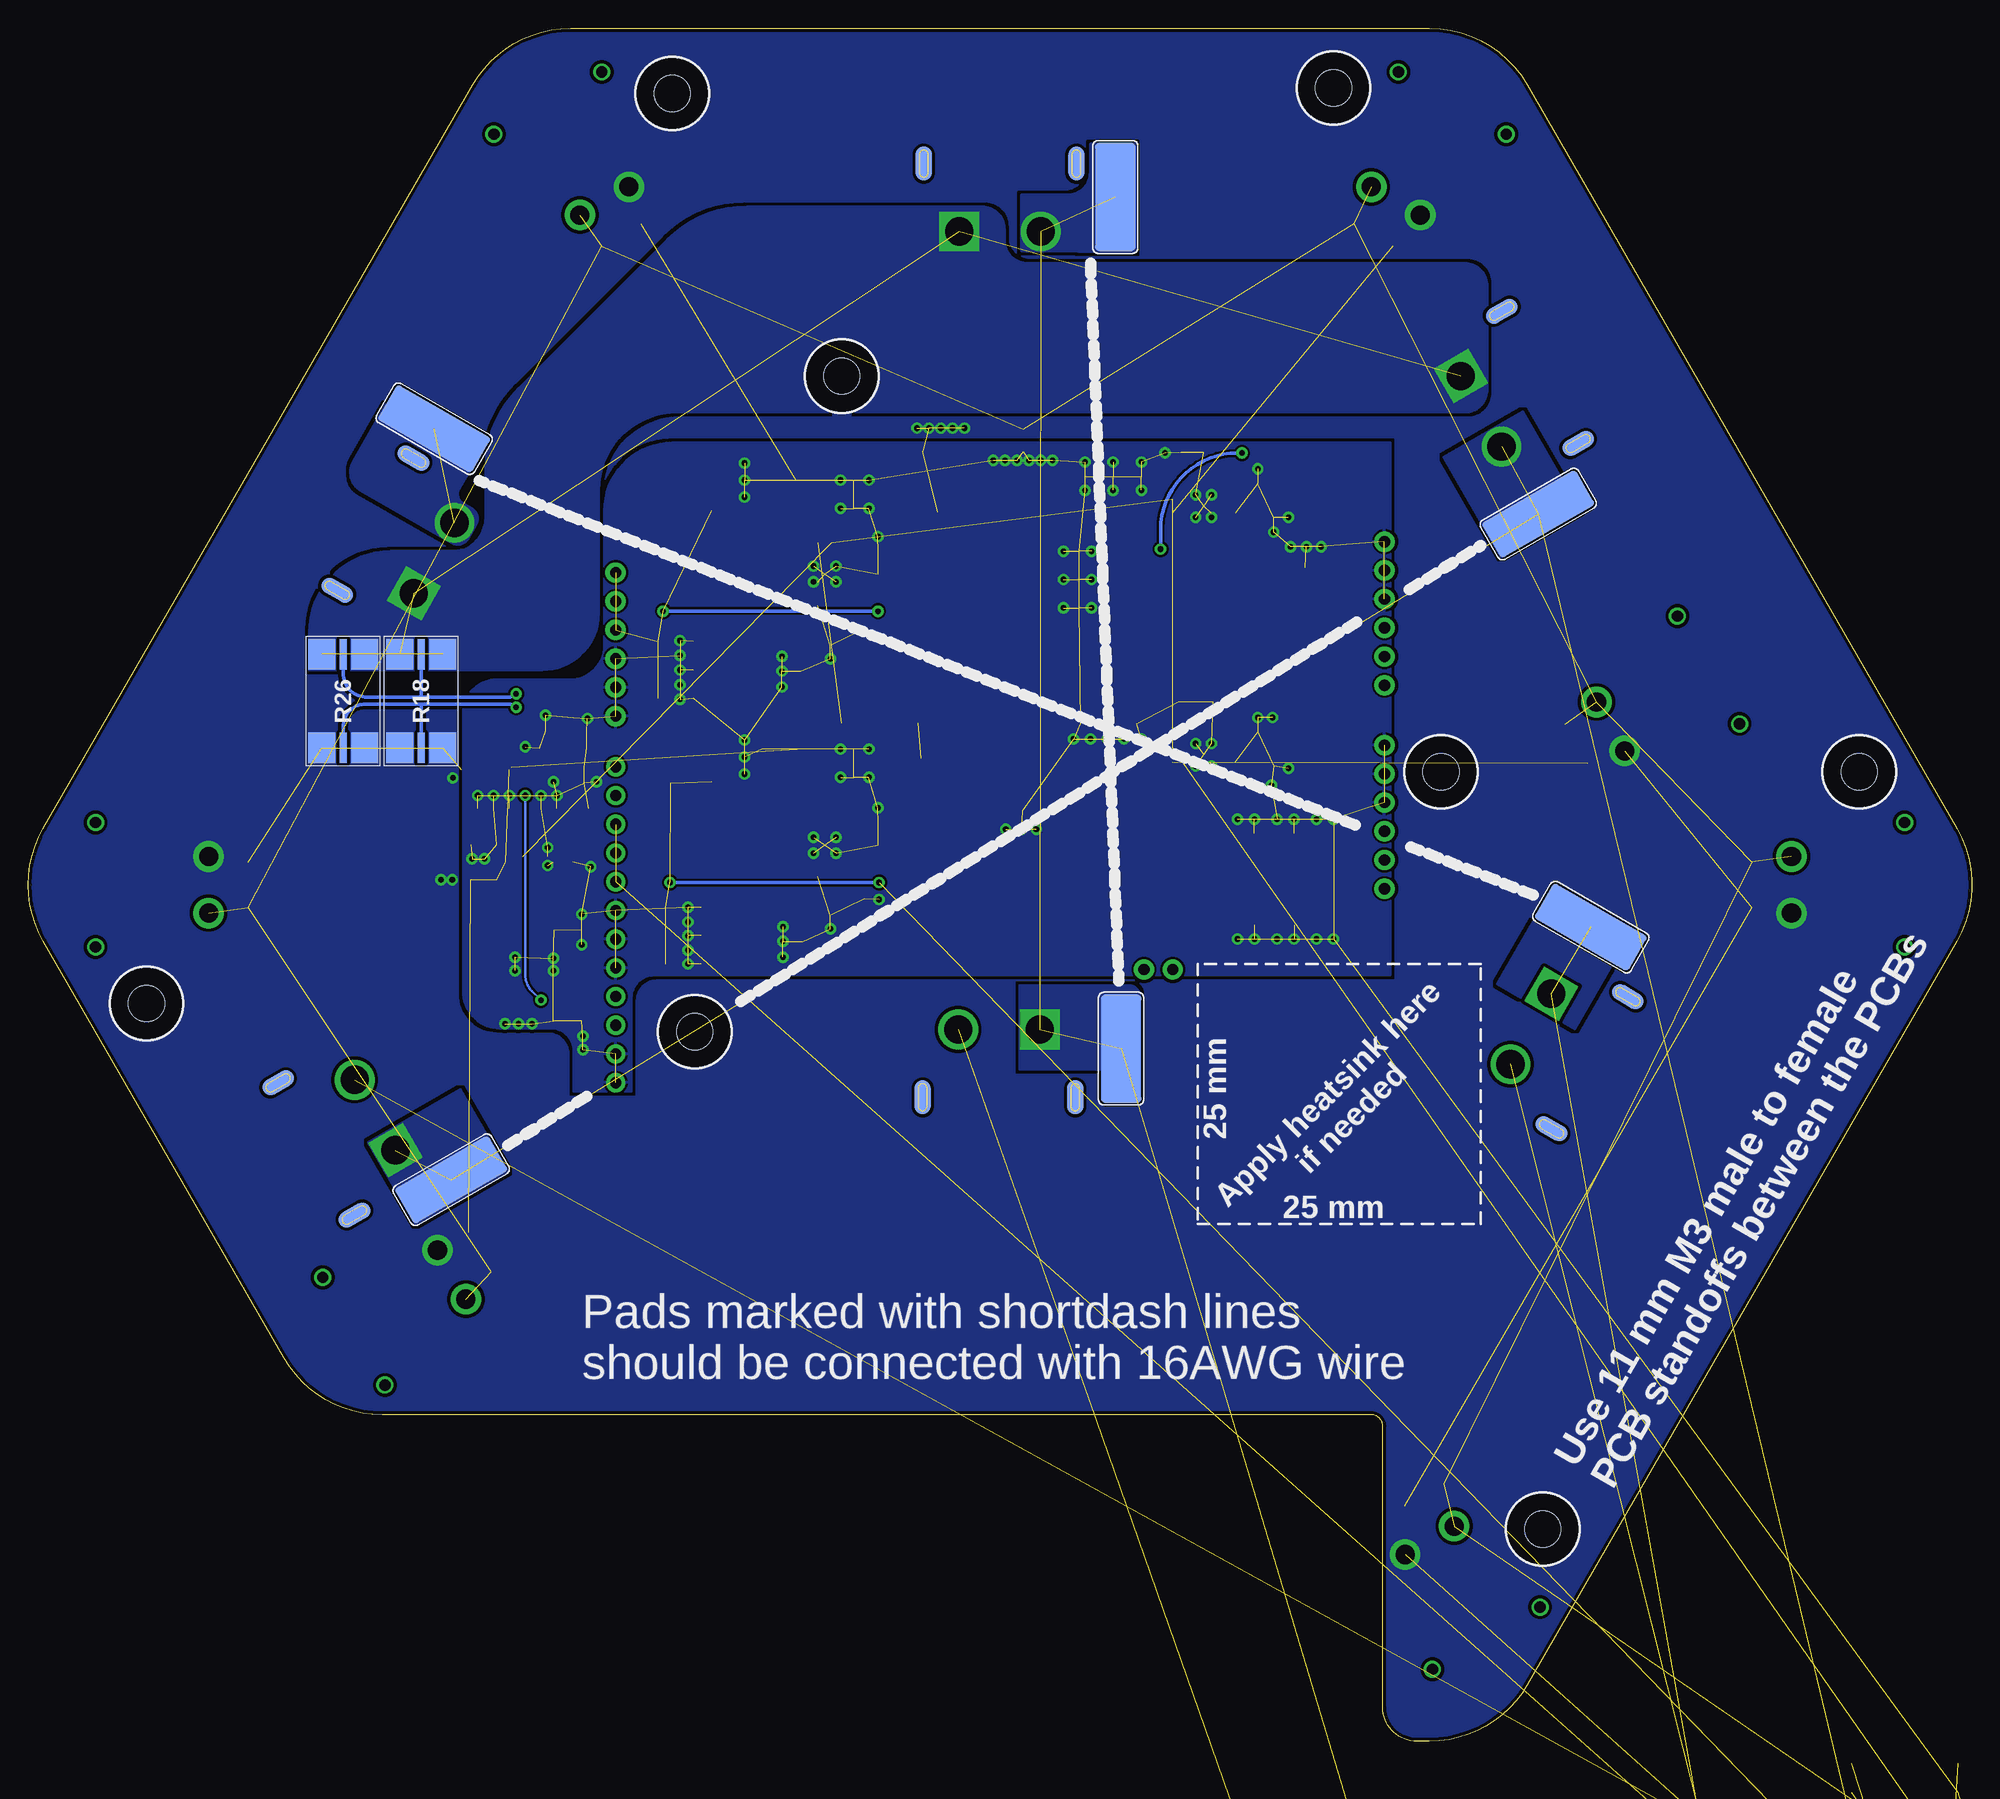
[diagram p5: board, bottom side, seen from below]

Size 171.89 x 151.55 mm. Coordinates in mm from the lower left corner, seen from the top.
Outline: 47.97,0 49.09,0 arc90 52.09,3 52.09,27.88 arc-90 53.09,28.88 140.59,28.88 arc60 149.25,33.88 170.55,70.78 arc60 170.55,80.78 132.58,146.55 arc60 123.92,151.55 47.97,151.55 arc60 39.3,146.55 1.33,80.78 arc60 1.33,70.78 39.3,5 arc60 47.97,0
Copper layers (1*16): Top 0.035mm / dielectric 1.5mm / Bottom 0.035mm
Design rules "JLCPCB 4 layer *": minimum track width 0.15mm, minimum drill 0.2mm, track to track 0.2mm, track to pad 0.2mm, pad to pad 0.2mm, via to via 0.2mm, smd to smd 0.2mm, copper to edge 0.3mm, drill to drill 0.2mm, minimum pad ring 0.125mm, minimum via ring 0.125mm, stop-mask expansion 1mil, vias tented up to drill 0.5mm, thermal gap 8mil
Holes 3.2 mm at 9.94,85.78 37.94,18.78 114.94,145.78 161.44,65.28 56.44,146.28 99.94,120.78 46.94,85.78 112.94,62.78
tRestrict: area 6.7,82.5 to 13.2,89; area 34.7,15.5 to 41.2,22; area 111.7,142.5 to 118.2,149; area 158.2,62 to 164.7,68.5; area 53.2,143 to 59.7,149.5; area 96.7,117.5 to 103.2,124; area 43.7,82.5 to 50.2,89; area 109.7,59.5 to 116.2,66
bRestrict: area 6.7,82.5 to 13.2,89; area 34.7,15.5 to 41.2,22; area 111.7,142.5 to 118.2,149; area 158.2,62 to 164.7,68.5; area 53.2,143 to 59.7,149.5; area 96.7,117.5 to 103.2,124; area 43.7,82.5 to 50.2,89; area 109.7,59.5 to 116.2,66

### Footprints (pad centres in the part's own frame; a part is rotated, then mirrored left to right if it is on the bottom)
XT60PW-M = drill 2.5 square: + 3.6,-7.2 | drill 2.5: - -3.6,-7.2 | smd 1.4 x 3 bottom: P$1 -6.75,-1.2; P$2 6.75,-1.2 | smd 1.4 x 3: P$3 -6.75,-1.2; P$4 6.75,-1.2
C0603 = smd 0.6 x 0.9: 1 -0.725,0; 2 0.725,0
C1206 = smd 0.9 x 1.6: P$1 -1.55,0; P$2 1.55,0
C1210 = smd 0.9 x 2.5: 1 -1.55,0; 2 1.55,0
CAP_SMD_6.3X7.7 = smd 2.8 x 1: + 2.35,0; - -2.35,0
1X12-PTH-2.54-FEMALE = drill 1 pad 1.7: 1 -13.97,0; 2 -11.43,0; 3 -8.89,0; 4 -6.35,0; 5 -3.81,0; 6 -1.27,0; 7 1.27,0; 8 3.81,0; 9 6.35,0; 10 8.89,0; 11 11.43,0; 12 13.97,0
1X06-PTH-2.54-FEMALE = drill 1 pad 1.8: 1 -6.35,0; 2 -3.81,0; 3 -1.27,0; 4 1.27,0; 5 3.81,0; 6 6.35,0
1X02-PTH-2.54-FEMALE = drill 1 pad 1.8: 1 -1.27,0; 2 1.27,0
DO-214AB(SMC) = smd 1.6 x 3.1: A 3.05,0; C -3.05,0
SOT23 = smd 1 x 1: 1 1.1,-0.95; 2 1.1,0.95; 3 -1.1,0
DO-214AA(SMB) = smd 1.5 x 2.2: A -2,0; C 2,0
SOD323 = smd 1 x 0.6: A 1.1,0; C -1.1,0
SOIC8-POWERPAD = smd 0.6 x 1.9: 1 -1.905,-2.78; 2 -0.635,-2.78; 3 0.635,-2.78; 4 1.905,-2.78; 5 1.905,2.78; 6 0.635,2.78; 7 -0.635,2.78; 8 -1.905,2.78 | smd 3.1 x 2.4: P$1 0,0
SOT23-5 = smd 1.2 x 0.55: 1 1.3,-0.95; 2 1.3,0; 3 1.3,0.95; 4 -1.3,0.95; 5 -1.3,-0.95
4-SMD = smd 1.5 x 1.3: 1 -4.7,1.27; 2 -4.7,-1.27; 3 4.7,-1.27; 4 4.7,1.27
TSSOP20 = smd 0.305 x 0.991: 1 -2.925,-2.918; 2 -2.275,-2.918; 3 -1.625,-2.918; 4 -0.975,-2.918; 5 -0.325,-2.918; 6 0.325,-2.918; 7 0.975,-2.918; 8 1.625,-2.918; 9 2.275,-2.918; 10 2.925,-2.918; 11 2.925,2.918; 12 2.275,2.918; 13 1.625,2.918; 14 0.975,2.918; 15 0.325,2.918; 16 -0.325,2.918; 17 -0.975,2.918; 18 -1.625,2.918; 19 -2.275,2.918; 20 -2.925,2.918
MSOP10 = smd 1.45 x 0.3: 1 -2.2,1; 2 -2.2,0.5; 3 -2.2,0; 4 -2.2,-0.5; 5 -2.2,-1; 6 2.2,-1; 7 2.2,-0.5; 8 2.2,0; 9 2.2,0.5; 10 2.2,1 | smd 1.9 x 2.6: EP 0,0
CONNECTION_7MM = smd 2 x 7: 1 -1,0; 2 1,0
IHLP-2020BZ-01 = smd 1.9 x 2.8: P$1 -2.5,0; P$2 2.5,0
1064 = smd 3.4 x 2.4: 1 0,-4.1; 2 0,4.1
SRP1265A = smd 3.1 x 5: 1 -5.55,0; 2 5.55,0
XT30-RA = drill 1.7 pad 2.7: + -2.5,0; - 2.5,0 | drill 1 pad 1.5: P$3 -5.5,10; P$4 5.5,10
10X4 = smd 3.6 x 9.6: P$1 0,0
D-PAK = smd 5.4 x 6.2: D 0,2.5 | smd 1 x 1.6: G -2.28,-4.8; S 2.28,-4.8
R0603 = smd 0.6 x 0.9: 1 -0.725,0; 2 0.725,0
R3920-KELVIN = smd 2.7 x 2.4: 1 -4.15,1.9; 2 4.15,1.9; 11 -4.15,-1.9; 22 4.15,-1.9 | smd 2.7 x 0.6: S1 -4.15,0; S2 4.15,0
1-1825910-4 = drill 1: 1 -3.25,2.25; 2 3.25,2.25; 3 -3.25,-2.25; 4 3.25,-2.25

### Placement (x,y rotation side)
B1H  37.15,121.27 60 top
B1L  147.46,51.8 240 top
B2H  85.94,140.78 0 top
B2L  86.04,55.78 180 top
B3H  142.23,108.28 300 top
B3L  32.75,59.43 120 top
C1  104.94,79.28 270 top
C2  105.44,87.78 180 top
C3  100.44,87.78 0 top
C4  100.44,85.28 0 top
C5  97.94,73.78 270 top
C6  100.94,73.78 90 top
C7  113.94,73.78 0 top
C8  113.94,71.28 0 top
C9  113.94,68.78 0 top
C10  70.44,83.78 180 top
C11  78.84,88.48 270 top
C12  76.34,88.48 270 top
C13  73.84,88.48 270 top
C14  62.44,89.28 180 top
C15  62.44,86.28 0 top
C16  104.94,103.28 270 top
C17  105.54,111.58 180 top
C18  100.44,111.58 0 top
C19  100.44,109.08 0 top
C20  97.94,97.68 270 top
C21  100.94,97.68 90 top
C22  114.64,97.28 0 top
C23  114.64,94.78 0 top
C24  114.64,92.28 0 top
C25  67.94,105.78 180 top
C26  78.44,110.28 270 top
C27  75.94,110.28 270 top
C28  63.44,78.78 270 top
C29  56.44,73.78 90 top
C30  63.44,73.78 90 top
C31  59.94,78.78 270 top
C32  59.94,73.78 90 top
C33  73.44,110.28 270 top
C34  62.44,111.28 180 top
C35  62.44,108.28 0 top
C36  77.44,100.28 180 top
C37  77.44,102.78 180 top
C38  77.44,105.28 180 top
C39  123.69,91.28 90 top
C40  125.94,87.88 180 top
C41  123.44,86.18 0 top
C42  56.44,78.78 270 top
C43  122.94,65.28 270 top
C44  132.74,77.78 270 top
C45  132.14,81.78 90 top
C46  -6.06,-33.22 0 top  (outside the outline)
C47  -3.06,-33.22 0 top  (outside the outline)
C48  -3.06,-51.22 0 top  (outside the outline)
C49  -6.06,-171.22 0 top  (outside the outline)
C50  -5.06,-173.22 0 top  (outside the outline)
C51  -6.06,-176.22 0 top  (outside the outline)
C52  -6.06,-179.22 0 top  (outside the outline)
C54  130.44,77.78 270 top
C56  125.44,65.28 270 top
C57  122.94,70.28 90 top
C58  126.64,75.78 0 top
C62  130.74,81.78 90 top
C87  122.34,81.78 90 top
C88  125.14,81.78 90 top
CON1  119.94,72.24 90 top
CON2  51.94,81.78 270 top
CON3  71.94,68.28 180 top
CON4  119.94,97.05 270 top
CON7  51.94,99.78 90 top
D1  106.44,70.78 180 top
D2  83.94,79.28 90 top
D3  106.64,94.68 180 top
D4  58.94,100.78 90 top
D5  -5.06,-75.22 0 top  (outside the outline)
D6  119.44,133.28 150 top
D7  152.44,75.78 90 top
D8  19.44,75.78 270 top
D9  48.44,21.78 330 top
D10  128.44,71.78 180 top
D11  52.94,133.28 210 top
D12  131.94,43.28 60 top
D13  34.94,88.28 240 top
D14  1.94,-22.22 0 top  (outside the outline)
D15  -5.06,-88.22 0 top  (outside the outline)
D16  6.94,-108.22 0 top  (outside the outline)
D17  -5.06,-113.22 0 top  (outside the outline)
D18  10.94,-157.22 0 top  (outside the outline)
D19  14.94,-157.22 0 top  (outside the outline)
IC1  101.44,79.28 180 top
IC2  67.94,87.28 90 top
IC3  101.44,103.28 180 top
IC4  67.94,109.28 90 top
IC5  126.14,90.68 270 top
IC6  5.94,-3.22 0 top
IC7  -4.06,-24.22 0 top  (outside the outline)
IC8  -5.06,-30.22 0 top  (outside the outline)
IC9  -1.06,-79.22 0 top  (outside the outline)
IC10  125.94,78.28 180 top
IC11  -1.06,-109.22 0 top  (outside the outline)
IC12  2.94,-158.22 0 top  (outside the outline)
J1  83.89,115.08 270 top
L1  130.94,65.78 180 top
L2  111.44,80.78 0 top
L3  72.94,76.28 180 top
L4  111.44,104.78 0 top
L5  68.44,99.28 270 top
M1  120.94,136.28 330 top
M2  155.94,75.78 270 top
M3  134.44,41.28 240 top
M4  47.94,17.78 150 top
M5  15.94,75.78 90 top
M6  50.94,136.28 30 top
M7  31.94,89.78 60 top
PAD1  33.69,72.03 240 bottom
PAD2  135.99,116.13 60 bottom
PAD3  75.24,61.28 0 bottom
PAD4  38.34,108.58 300 bottom
PAD5  75.74,136.63 180 bottom
PAD8  134.49,49.68 120 bottom
Q1  -5.06,-36.22 0 top  (outside the outline)
Q2  -5.06,-66.22 0 top  (outside the outline)
Q3  -5.06,-69.22 0 top  (outside the outline)
Q4  3.94,-12.22 0 top  (outside the outline)
Q5  -1.06,-113.22 0 top  (outside the outline)
Q6  2.94,-113.22 0 top  (outside the outline)
Q7  -3.06,-100.22 0 top  (outside the outline)
Q8  18.94,-157.22 0 top  (outside the outline)
Q9  -5.06,-168.22 0 top  (outside the outline)
Q10  12.94,-143.22 0 top  (outside the outline)
R1  97.44,81.28 0 top
R2  99.44,73.78 90 top
R3  97.44,77.28 180 top
R4  97.44,79.28 0 top
R5  70.14,91.28 270 top
R6  62.44,87.78 0 top
R7  65.64,91.28 90 top
R8  68.64,91.28 270 top
R9  97.44,105.28 0 top
R10  99.44,97.68 90 top
R11  97.44,101.28 180 top
R12  97.44,103.28 0 top
R13  69.94,113.28 270 top
R14  62.44,109.78 0 top
R15  65.94,113.28 90 top
R16  67.94,113.28 270 top
R17  67.14,91.28 270 top
R18  137.14,92.03 270 bottom
R19  1.94,-19.22 0 top  (outside the outline)
R20  123.44,84.78 0 top
R21  128.44,86.18 0 top
R22  125.94,86.18 0 top
R23  -5.06,-39.22 0 top  (outside the outline)
R24  -5.06,-55.22 0 top  (outside the outline)
R25  129.34,81.78 270 top
R26  144.04,92.03 270 bottom
R27  127.94,81.78 90 top
R28  126.54,81.78 270 top
R29  123.74,81.78 90 top
R30  1.94,-25.22 0 top  (outside the outline)
R31  1.94,-27.22 0 top  (outside the outline)
R32  -5.06,-57.22 0 top  (outside the outline)
R33  -6.06,-60.22 0 top  (outside the outline)
R34  -6.06,-63.22 0 top  (outside the outline)
R35  -5.06,-72.22 0 top  (outside the outline)
R36  -5.06,-82.22 0 top  (outside the outline)
R37  -5.06,-90.22 0 top  (outside the outline)
R38  -5.06,-92.22 0 top  (outside the outline)
R39  5.94,-113.22 0 top  (outside the outline)
R40  -6.06,-116.22 0 top  (outside the outline)
R41  -3.06,-116.22 0 top  (outside the outline)
R42  -0.06,-116.22 0 top  (outside the outline)
R43  2.94,-116.22 0 top  (outside the outline)
R44  5.94,-116.22 0 top  (outside the outline)
R45  -2.06,-168.22 0 top  (outside the outline)
R46  0.94,-168.22 0 top  (outside the outline)
R47  3.94,-168.22 0 top  (outside the outline)
R48  6.94,-168.22 0 top  (outside the outline)
R49  9.94,-168.22 0 top  (outside the outline)
R50  12.94,-168.22 0 top  (outside the outline)
R51  -5.06,-181.22 0 top  (outside the outline)
RL  123.24,89.18 0 top
RL1  123.24,87.88 0 top
SW1  -3.06,-44.22 0 top  (outside the outline)

### Tracks (layer width: path | path; a pad name or v marks a point on that pad's centre or on a via)
5V_FMU_CTRL  (1 unrouted)
5VFMU  (via drill 0.5 pad 1)  (10 unrouted)
  Top 0.3: IC5.5 125.19,91.85 123.84,91.85 C39.2 123.69,91.85 122.84,91.85 arc90 121.44,90.45 121.44,89.58 arc-90 120.19,88.33 119.7,88.33 arc45 117.98,87.61 115.09,84.73
  Top 0.4: R3.2 96.72,75.98 v96.64,75.98
  Bottom 0.3: v115.14,75.98 v96.64,75.98
  pour Top (no thermals): 109.94,85.88 109.94,81.28 112.44,81.28 arc-90 114.44,79.28 114.44,68.18 116.04,68.18 arc90 117.44,69.58 117.44,73.28 arc-90 119.44,75.28 120.64,75.28 120.64,82.18 118.44,82.18 arc-90 116.44,84.18 arc90 114.74,85.88
B1MID  (6 unrouted)
  pour Bottom (no thermals): 39.72,117.64 34.62,108.79 41.59,104.77 46.7,113.61
  pour Bottom (no thermals): 133.69,57.68 129.5,50.43 137.63,45.73 141.81,52.99
B2MID  (1 unrouted)
  pour Bottom (no thermals): 36.9,75.8 30.05,71.84 35.13,63.04 41.98,66.99
  pour Bottom (no thermals): 140.27,118.23 132.19,113.57 133.77,110.85 arc-90 133.4,109.48 132.65,109.04 arc90 132.28,107.68 133.04,106.37 arc90 134.4,106 142.49,110.67 arc90 143.17,113.21
B2MID1  (4 unrouted)
B3MID  (6 unrouted)
  pour Bottom (no thermals): 84.19,66.87 74.58,66.87 arc90 73.58,65.87 73.58,59.44 84.19,59.44
  pour Bottom (no thermals): 84.04,131.88 74.04,131.78 74.04,141.28 77.94,141.28 77.94,138.78 arc90 79.94,136.78 84.04,136.78
BAT1_CTRL  (1 unrouted)
BAT2_CTRL  (1 unrouted)
BAT3_CTRL  (1 unrouted)
BAT_V  (2 unrouted)
BATNEG
  Top 0.5: CON3.1 73.41,68.08 arc-45 73.99,66.67 73.99,63.73
  pour Top (rank 3, no thermals): 133.12,50.78 arc-90 124.02,41.68 49.09,41.68 arc-90 39.09,51.68 39.09,59.83 arc-90 41.09,61.83 42.09,61.83 arc-90 44.09,59.83 44.09,53.88 arc90 45.19,52.78 71.84,52.78 arc90 73.84,54.78 73.84,66.78 77.44,66.78 arc-90 78.94,65.28 78.94,61.18 arc90 80.44,59.68 84.44,59.68 arc90 85.94,61.18 85.94,65.28 arc-90 87.44,66.78 106.84,66.78 arc-90 108.34,65.28 108.34,61.18 arc90 112.84,56.68 122.24,56.68 arc90 124.14,58.58 arc-90 126.14,60.58 142.97,60.58 arc-90 144.97,58.58 144.97,58.03 arc-90 142.97,56.03 138.37,56.03 arc90
BATNEG_1  (4 unrouted)
BATNEG_2  (3 unrouted)
BATNEG_3  (3 unrouted)
BATT_CURRENT
  Top 0.2: C40.2 RL1.2 RL.2 124.17,89.38 IC5.1
  Top 0.3: RL1.2 123.82,87.73 123.82,87.33 arc-90 123.52,87.03 121.59,87.03 arc45 120.18,86.44 CON1.12
BATT_VOLTAGE
  Top 0.2: R20.2 123.97,84.58 123.97,84.38 arc-90 123.22,83.63 119.98,83.63 CON1.11
  Top 0.5: R22.1 C41.2 R20.2
BOOT
  Top 0.3: IC10.1 127.54,77.28 127.54,76.15 127.37,75.98 C58.2
BOOT1
  Top 0.6: C1.1 104.9,80 103.35,81.56 IC1.1
BOOT2
  Top 0.6: IC3.1 103.35,105.66 104.94,104.06 C16.1
BOOT3
  Top 0.6: IC4.1 70.32,107.37 68.73,105.78 C25.1
BUTTON  (1 unrouted)
DC-DC_EN  (4 unrouted)
GND  (via drill 0.5 pad 1)  (234 unrouted)
  Top 0.3: IC10.9 125.44,77.78 IC10.EP
  Top 0.6: IC1.7 102.08,78.21 v102.44,78.58 | IC3.7 102.08,102.58 v102.44,102.58 | IC4.7 67.24,108.64 v67.24,108.28 | IC2.7 67.31,86.64 IC2.P$1
  other vias: 97.54,87.78 97.54,85.28 100.04,87.78 100.04,85.28 102.44,79.98 100.44,78.58 100.44,79.98 113.54,68.78 113.54,71.28 113.54,73.78 97.54,111.58 97.54,109.08 100.04,111.58 100.04,109.08 102.44,103.98 100.44,102.58 100.44,103.98 114.24,92.18 114.24,94.78 114.24,97.38 78.44,113.18 75.94,113.18 73.44,113.18 78.44,110.68 75.94,110.68 73.44,110.68 68.64,108.28 67.24,110.28 68.64,110.28 77.84,105.28 77.84,102.78 77.84,100.28 80.34,105.28 80.34,102.78 80.34,100.28 56.44,70.98 59.94,70.98 63.44,70.98 56.44,81.58 59.94,81.58 63.44,81.58 96.74,82.58 96.74,106.58 100.94,95.78 105.24,95.98 105.24,94.68 105.24,93.28 105.14,72.08 105.14,70.78 105.14,69.38 100.94,71.88 96.64,74.48 113.54,72.48 113.54,69.98 114.24,96.08 114.24,93.48 57.94,70.98 61.44,70.98 64.94,70.98 57.94,81.58 61.44,81.58 64.94,81.58 82.74,80.68 84.04,80.68 85.44,80.68 57.54,105.68 58.84,105.68 60.24,105.68 60.44,108.28 61.74,106.98 63.14,112.58 71.34,113.98 63.14,90.58 60.44,86.08 61.94,84.58 73.44,88.68 74.99,88.68 76.44,88.68 77.94,88.68 79.44,88.68 108.54,111.58 108.54,113.08 108.54,110.08 108.54,88.58 108.54,87.08 108.54,85.58 61.84,90.58 67.24,88.28 68.64,88.28 68.64,86.28 67.24,86.28 122.44,90.48 121.64,84.88 125.44,84.88 127.94,87.98 126.14,90.78 122.94,70.48 122.94,73.18 122.84,62.38 122.84,61.18 127.34,63.48 128.54,63.48 129.74,63.48 125.44,69.28 128.84,69.38 125.44,68.18 128.84,68.18 131.54,78.08 132.64,78.08 132.14,83.68 130.74,83.68 129.34,83.68 126.54,83.68 125.14,83.68 122.14,77.38 125.94,79.08 125.94,77.48 81.29,113.33 82.34,113.33 83.39,113.33 84.44,113.33 85.49,113.33 86.54,113.33
  pour Bottom: 51.44,114.88 114.94,114.88 arc-90 120.94,108.88 120.94,96.93 arc90 123.94,93.93 130.44,93.93 arc-90 133.44,90.93 133.44,66.38 arc-90 130.14,63.08 125.64,63.08 arc90 123.64,61.08 123.64,57.48 118.54,57.48 118.54,65.78 arc90 116.54,67.78 51.44,67.78
  pour Top (rank 2): 51.44,114.88 114.94,114.88 arc-90 120.94,108.88 120.94,96.93 arc90 123.94,93.93 130.44,93.93 arc-90 133.44,90.93 133.44,66.38 arc-90 130.14,63.08 125.64,63.08 arc90 123.64,61.08 123.64,59.18 arc-90 121.64,57.18 120.54,57.18 arc-90 118.54,59.18 118.54,65.78 arc90 116.54,67.78 72.94,67.78 72.94,70.28 54.94,70.28 54.94,73.78 50.95,73.78
MID1_V  (2 unrouted)
MID2_V  (2 unrouted)
MID3_V  (2 unrouted)
N$1
  Top 0.4: IC1.4 99.54,81.28 R1.2
N$2
  Top 0.4: IC3.4 99.54,105.28 R9.2
N$3
  Top 0.4: IC1.6 100.81,74.64 99.31,74.64 R2.2 C6.2
N$4
  Top 0.4: C5.2 R2.1
N$5
  Top 0.4: R4.2 R3.1 99.54,77.28 IC1.5
N$6
  Top 0.4: IC3.6 100.81,98.4 C21.2 R10.2
N$7
  Top 0.6: IC2.1 71.17,85.37 C10.1
N$8
  pour Top (no thermals): 64.24,85.58 66.04,85.58 66.86,84.76 arc45 68.27,84.18 69.94,84.18 69.94,83.28 72.78,80.44 arc45 76.31,78.98 83.44,78.98 arc-90 85.44,76.98 85.44,75.78 arc-90 83.44,73.78 77.41,73.78 arc-45 73.88,75.24 64.24,84.88
N$9
  Top 0.2: R5.2 70.14,89.18 IC2.4
N$10
  Top 0.2: C15.2 R6.2 63.17,87.88 63.2,87.91 IC2.6
N$11
  Top 0.2: C14.2 R6.1
N$12
  Top 0.2: R8.2 R17.2 R7.1 65.64,89.16 65.62,89.18 IC2.5
N$13
  Top 0.4: C20.2 R10.1
N$14
  Top 0.4: IC4.4 69.94,111.18 R13.2
N$15
  Top 0.4: R12.2 R11.1 99.54,101.28 IC3.5
N$16
  Top 0.4: IC4.6 63.3,109.91 R14.2 C35.2
N$17
  Top 0.4: C34.2 R14.1
N$18
  Top 0.4: R16.2 R15.1 65.94,111.18 IC4.5
N$19  (via drill 0.5 pad 1)
  Top 0.3: IC5.4 127.09,91.58 128.5,91.58 arc-45 v128.74,91.48
  Bottom 0.3: 137.14,91.78 129.46,91.78 arc45 v128.75,91.48 v128.74,91.48 | R26.S2 144.04,89.78 arc90 142.04,91.78 137.14,91.78 | R18.S2 137.14,91.78
N$20
  Top 0.3: IC10.4 129.04,78.78 arc90 129.24,78.98 129.24,79.93 arc-90 129.64,80.33 129.81,80.33 arc45 130.16,80.47 C62.1 C45.1
N$21  (via drill 0.5 pad 1)
  Top 0.3: IC5.3 127.09,89.78 128.99,89.78 arc90 129.69,90.48 129.69,91.98 arc90 128.99,92.68 v128.74,92.68
  Bottom 0.3: 137.14,92.38 141.94,92.38 arc90 144.04,94.48 R26.S1 | v128.74,92.68 v128.75,92.67 arc45 129.46,92.38 137.14,92.38 | R18.S1 137.14,92.38
N$22
  Top 0.5: R21.1 R22.2
N$23  (5 unrouted)
N$24  (1 unrouted)
N$25  (3 unrouted)
N$26  (1 unrouted)
N$27  (3 unrouted)
N$28  (3 unrouted)
N$29  (3 unrouted)
N$30  (1 unrouted)
N$31  (1 unrouted)
N$32  (3 unrouted)
N$33  (1 unrouted)
N$34  (3 unrouted)
N$35  (1 unrouted)
N$36  (1 unrouted)
N$37  (3 unrouted)
N$38
  Top 0.3: IC10.8 122.84,78.28 arc-90 122.04,79.08 122.04,81.05 C87.1 123.74,82.45 R29.2
N$39
  Top 0.3: IC10.5 128.74,79.28 128.74,80.35 arc-45 128.89,80.7 129.24,81.05 R25.2
N$40  (1 unrouted)
N$41  (3 unrouted)
N$42  (1 unrouted)
N$43  (1 unrouted)
N$50
  Top 0.3: C88.1 R29.1
PGND  (17 unrouted)
  pour Top (rank 4, no thermals): 123.92,151.55 47.97,151.55 arc60 39.3,146.55 1.33,80.78 arc60 1.33,70.78 39.3,5 arc60 47.97,0 49.09,0 arc90 52.09,3 52.09,27.88 arc-90 53.09,28.88 146.37,28.88 170.55,70.78 arc60 170.55,80.78 132.58,146.55 arc60
PH
  pour Top (no thermals): 123.09,77.33 124.19,77.33 125.34,76.18 126.44,76.18 126.44,75.68 arc90 127.84,74.28 134.34,74.28 134.34,64.48 131.54,64.48 131.54,68.38 123.09,76.83
PWRSW
  Top 0.3: CON3.2 70.69,68.28 70.69,57.51 arc45 71.28,56.09 72.07,55.3
SW1
  pour Top (no thermals): 103.14,75.58 103.14,77.38 104.54,78.78 111.94,78.78 arc-90 113.04,77.68 113.04,75.58 112.44,75.58 arc90 110.44,73.58 110.44,69.18 106.64,69.18 106.64,73.58 arc90 104.64,75.58
SW2
  pour Top (no thermals): 103.14,99.58 103.14,101.38 104.54,102.78 111.94,102.78 arc-90 113.04,101.68 113.04,99.58 112.44,99.58 arc90 110.44,97.58 110.44,92.68 106.64,92.68 106.64,97.58 arc90 104.64,99.58
SW3
  pour Top (no thermals): 64.24,107.58 66.04,107.58 67.44,106.18 67.44,98.98 arc-90 65.44,96.98 57.44,96.98 57.44,98.78 63.66,104.99 arc45 64.24,106.41
VBAT  (via drill 0.5 pad 1)  (27 unrouted)
  Top 0.3: IC10.2 129.64,77.78
  Top 0.5: R21.2 129.37,85.98 133.59,85.98 arc-90 v134.34,85.23
  Top 0.6: IC2.2 73.84,86.64 C13.P$2 | IC4.2 73.36,108.64 C33.P$2 | IC3.2 102.08,108.99 C19.P$2 | IC1.2 102.08,85.19 C4.P$2
  Top 1: C44.P$2 v135.39,76.23
  Top 1.5: C13.P$2 C12.P$2 C11.P$2 92.94,86.93 | C4.P$2 C3.P$2 | C3.P$2 C2.P$2 | C3.P$2 101.99,88.08 arc90 99.99,90.08 93.24,90.08 | C17.P$2 C18.P$2 | C19.P$2 C18.P$2 | C18.P$2 101.99,112.18 arc90 100.04,114.13 92.79,114.13 | C33.P$2 C27.P$2 C26.P$2 91.44,108.73
  Top 2: D8.C M5.+ | D13.C M7.+ | D11.C M6.+ | D9.C M4.+ | M3.+ D12.C | D7.C M2.+ | D6.C M1.+
  Bottom 0.3: v134.39,76.23 v135.39,76.23
  other vias: 89.09,116.18 90.14,116.18 91.19,116.18 92.24,116.18 93.29,116.18
  pour Top: 88.54,116.58 95.34,116.58 95.34,88.28 arc-90 93.34,86.28 88.54,86.28
  pour Bottom (rank 3, no thermals): 123.92,151.55 47.97,151.55 arc60 39.3,146.55 1.33,80.78 arc60 1.33,70.78 39.3,5 arc60 47.97,0 49.09,0 arc90 52.09,3 52.09,27.88 arc-90 53.09,28.88 146.37,28.88 170.55,70.78 arc60 170.55,80.78 132.58,146.55 arc60
  pour Top (no thermals): 133.44,76.58 131.66,76.58 arc-45 130.95,76.87 129.99,77.83 127.54,77.83 127.54,77.68 128.99,77.68 arc-90 129.64,77.03 129.64,75.88 133.44,75.88
VDC  (6 unrouted)
  pour Bottom (rank 2, no thermals): 108.3,135.78 87.54,135.78 arc90 85.54,133.78 85.54,132.78 arc-90 83.54,130.78 44.84,130.78 arc90 42.84,128.78 42.84,119.58 arc90 44.84,117.58 114.54,117.58 arc-90 121.44,110.68 121.44,99.78 arc90 126.44,94.78 147.04,94.78 147.04,98.08 arc90 139.84,105.28 134.44,105.28 arc-90 131.44,108.28 131.44,112.64 arc45 128.51,119.71 115.37,132.85 arc45
VDD_3V3  (7 unrouted)
VDD_4V  (via drill 0.5 pad 1)
  Top 0.2: R27.2 v127.94,83.68
  Bottom 0.2: v127.94,83.68 127.94,67.81 arc-45 127.36,66.39 v126.54,65.58
  pour Top (no thermals): 129.34,64.48 122.14,64.48 arc90 121.14,63.48 arc-90 120.14,62.48 119.74,62.48 arc-90 118.74,63.48 118.74,66.18 arc-90 119.74,67.18 121.14,67.18 arc90 122.14,68.18 122.14,69.18 123.74,69.18 123.74,68.18 arc90 124.74,67.18 129.34,67.18
VDD_5V  (via drill 0.5 pad 1)  (7 unrouted)
  Top 0.3: R11.2 96.72,99.98 v96.74,99.98
  Bottom 0.3: v96.74,99.98 v115.74,99.98
  pour Top (no thermals): 109.94,109.88 109.94,105.98 111.74,105.98 arc-90 115.44,102.28 115.44,91.68 117.34,91.68 arc90 118.34,92.68 118.34,96.29 arc-90 119.34,97.29 119.64,97.29 arc90 120.64,98.29 120.64,103.38 arc90 114.14,109.88
VDD_12V  (via drill 0.5 pad 1)
  Top 0.3: R15.2 65.92,113.98 v64.54,113.98
  Bottom 0.3: v71.74,105.48 71.74,107.18 arc90 64.94,113.98 v64.54,113.98
  pour Top (no thermals): 76.34,105.98 71.24,105.98 71.24,98.98 arc-90 68.24,95.78 53.94,95.78 arc-90 52.94,96.78 52.94,98.38 arc90 51.94,99.38 arc90 50.94,98.38 50.94,95.98 51.14,95.98 51.14,92.38 52.94,92.38 52.94,92.78 arc-90 53.94,93.78 73.34,93.78 arc90 76.34,96.78
VDD_24V
  Top 0.3: R7.2 65.54,91.9 62.24,91.9 arc90 60.34,90 60.34,88.98 arc-45 59.56,87.1 52.97,80.51
  pour Top (no thermals): 68.84,78.68 55.54,78.68 arc-90 53.94,80.28 arc90 52.74,81.48 51.84,81.48 arc90 51.14,80.78 51.14,73.88 68.84,73.88
VSENSE
  Top 0.3: R27.1 R28.2 126.24,81.05 126.24,80.68 arc-90 125.74,80.18 122.94,80.18 arc90 122.54,79.78 122.54,79.18 arc90 122.94,78.78 IC10.7

### Text on the board
tPlace: - | + | + | - | - | + | Pegas V3.1 / Power PCB mk0 / December 2022 | + | - | - | - | Payload power | + | 12V | - | + | - | + | + | - | 24V | + | + | - | + | + | - | - | - | + | + | - | Connect et non queri | - | +
bPlace: 25 mm | Apply heatsink here / if needed | 25 mm | Pads marked with shortdash lines / should be connected with 16AWG wire | Use 11 mm M3 male to female / PCB standoffs between the PCBs